# Altium project 724452_RPL-HX_Mobile_AEP_Rev0p91.PrjPcb (part 10 of 13)

## Sheet 0074_S0IX_REQ_ACK_OPTIO.SchDoc
size 848 x 558 mm
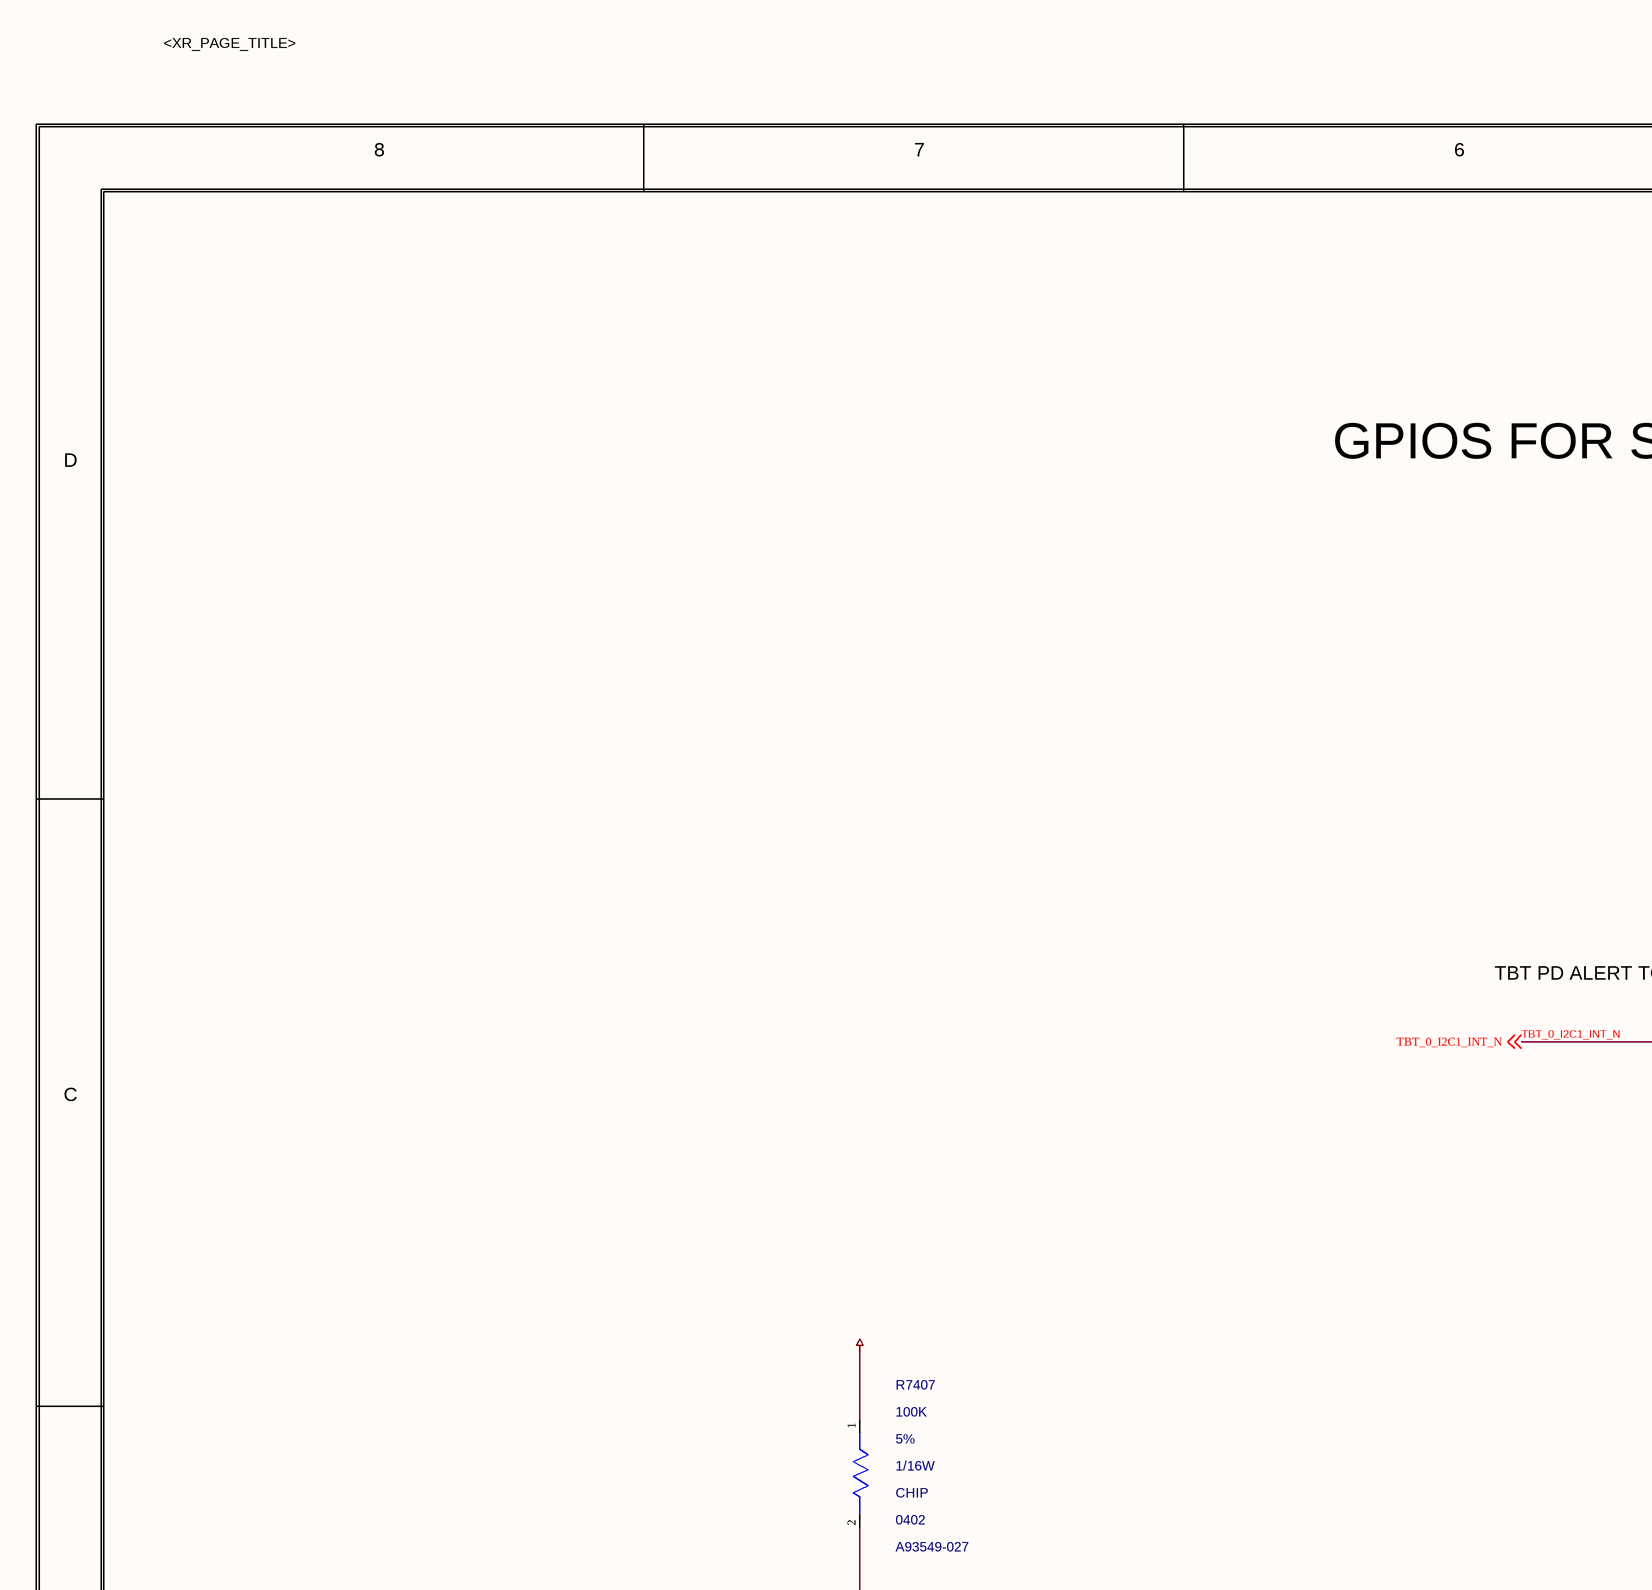
[diagram p122: 0074_S0IX_REQ_ACK_OPTIO.SchDoc, top left]
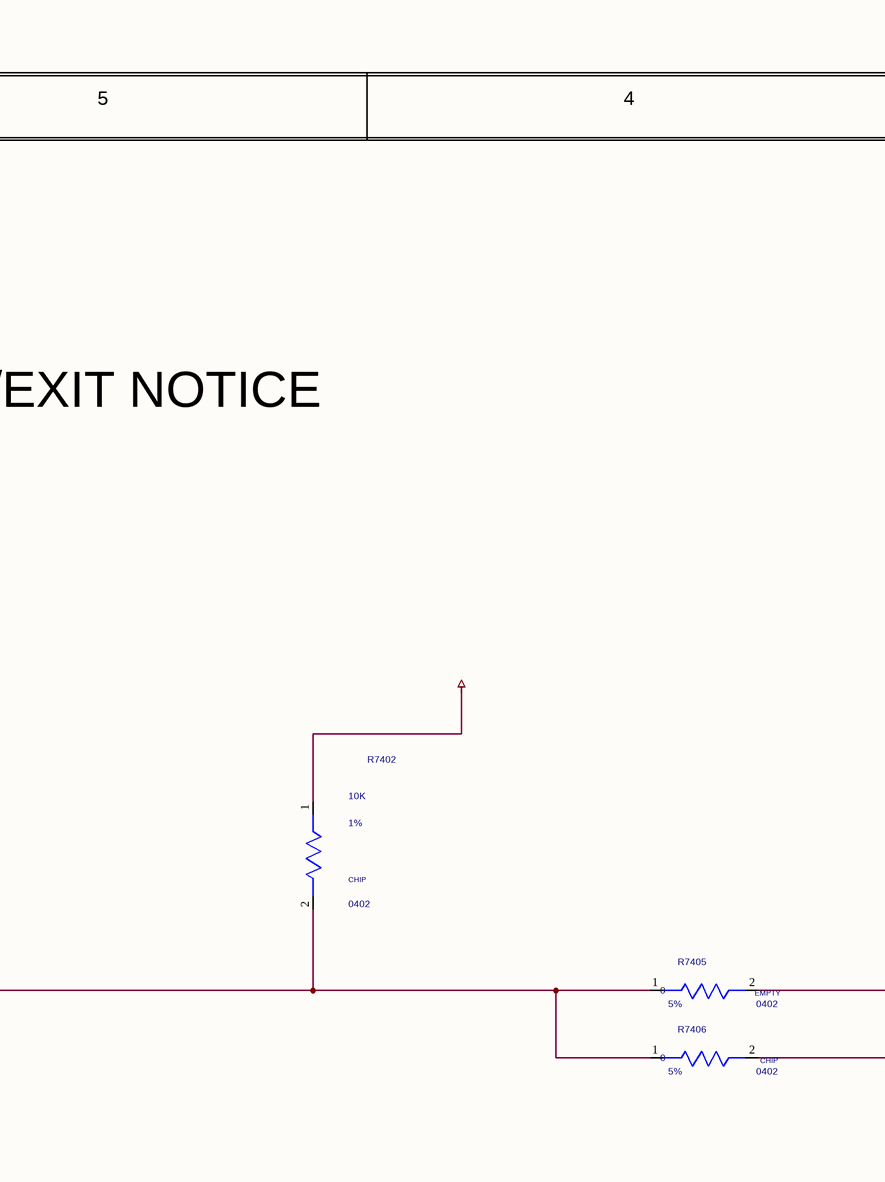
[diagram p123: 0074_S0IX_REQ_ACK_OPTIO.SchDoc, top middle]
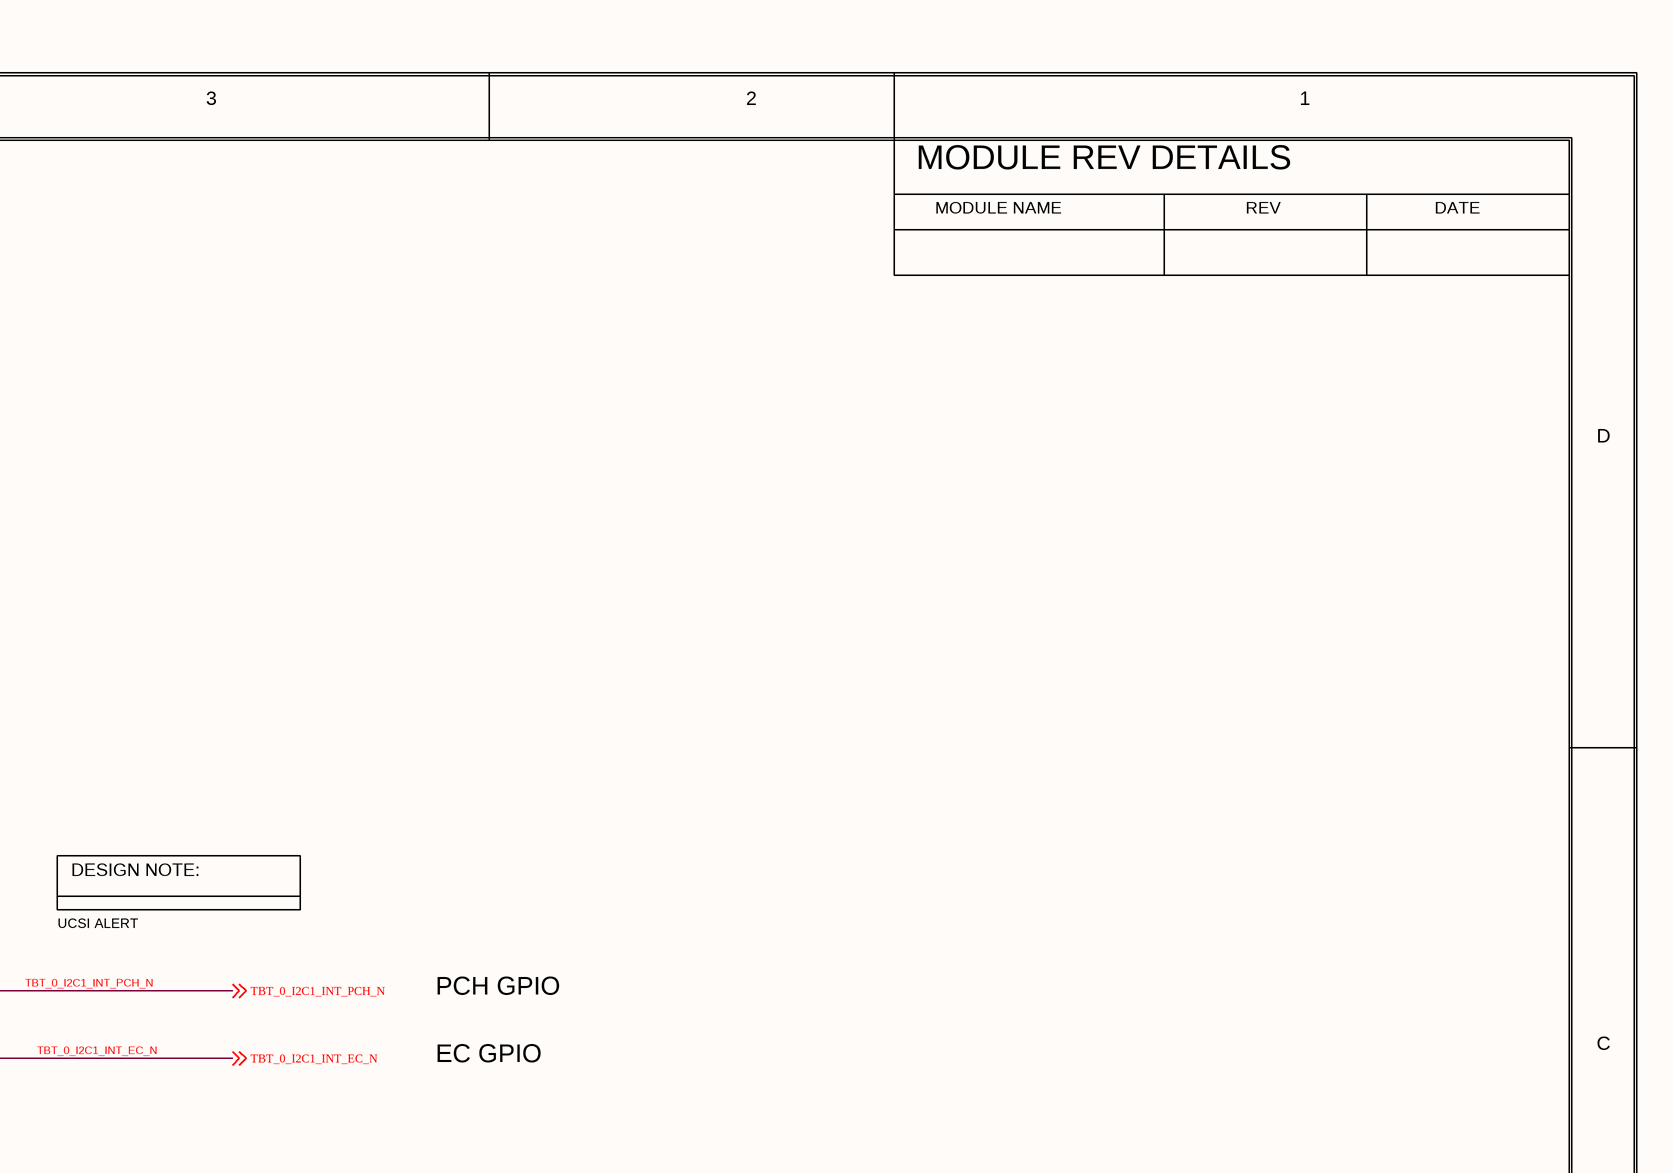
[diagram p124: 0074_S0IX_REQ_ACK_OPTIO.SchDoc, top right]
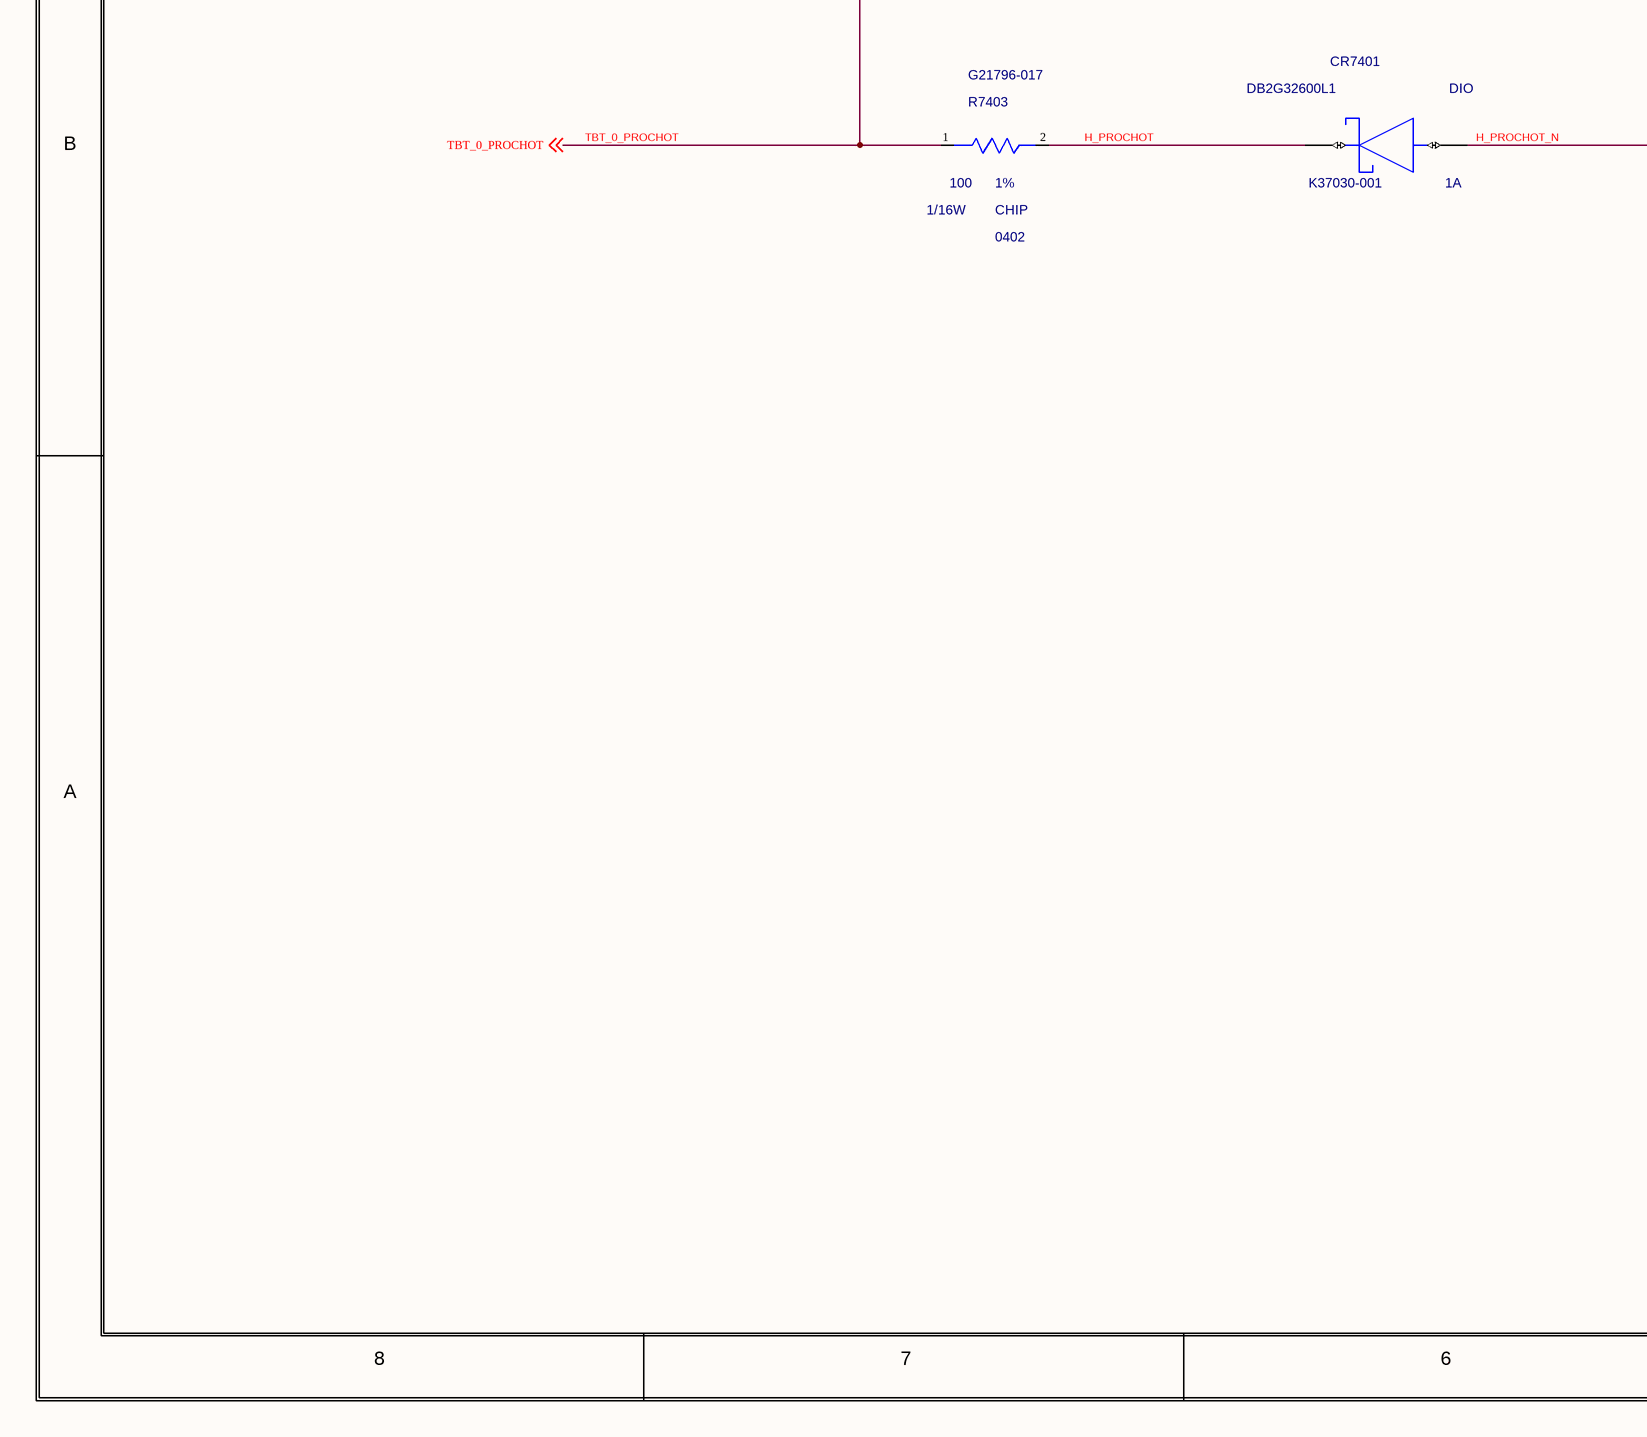
[diagram p125: 0074_S0IX_REQ_ACK_OPTIO.SchDoc, bottom left]
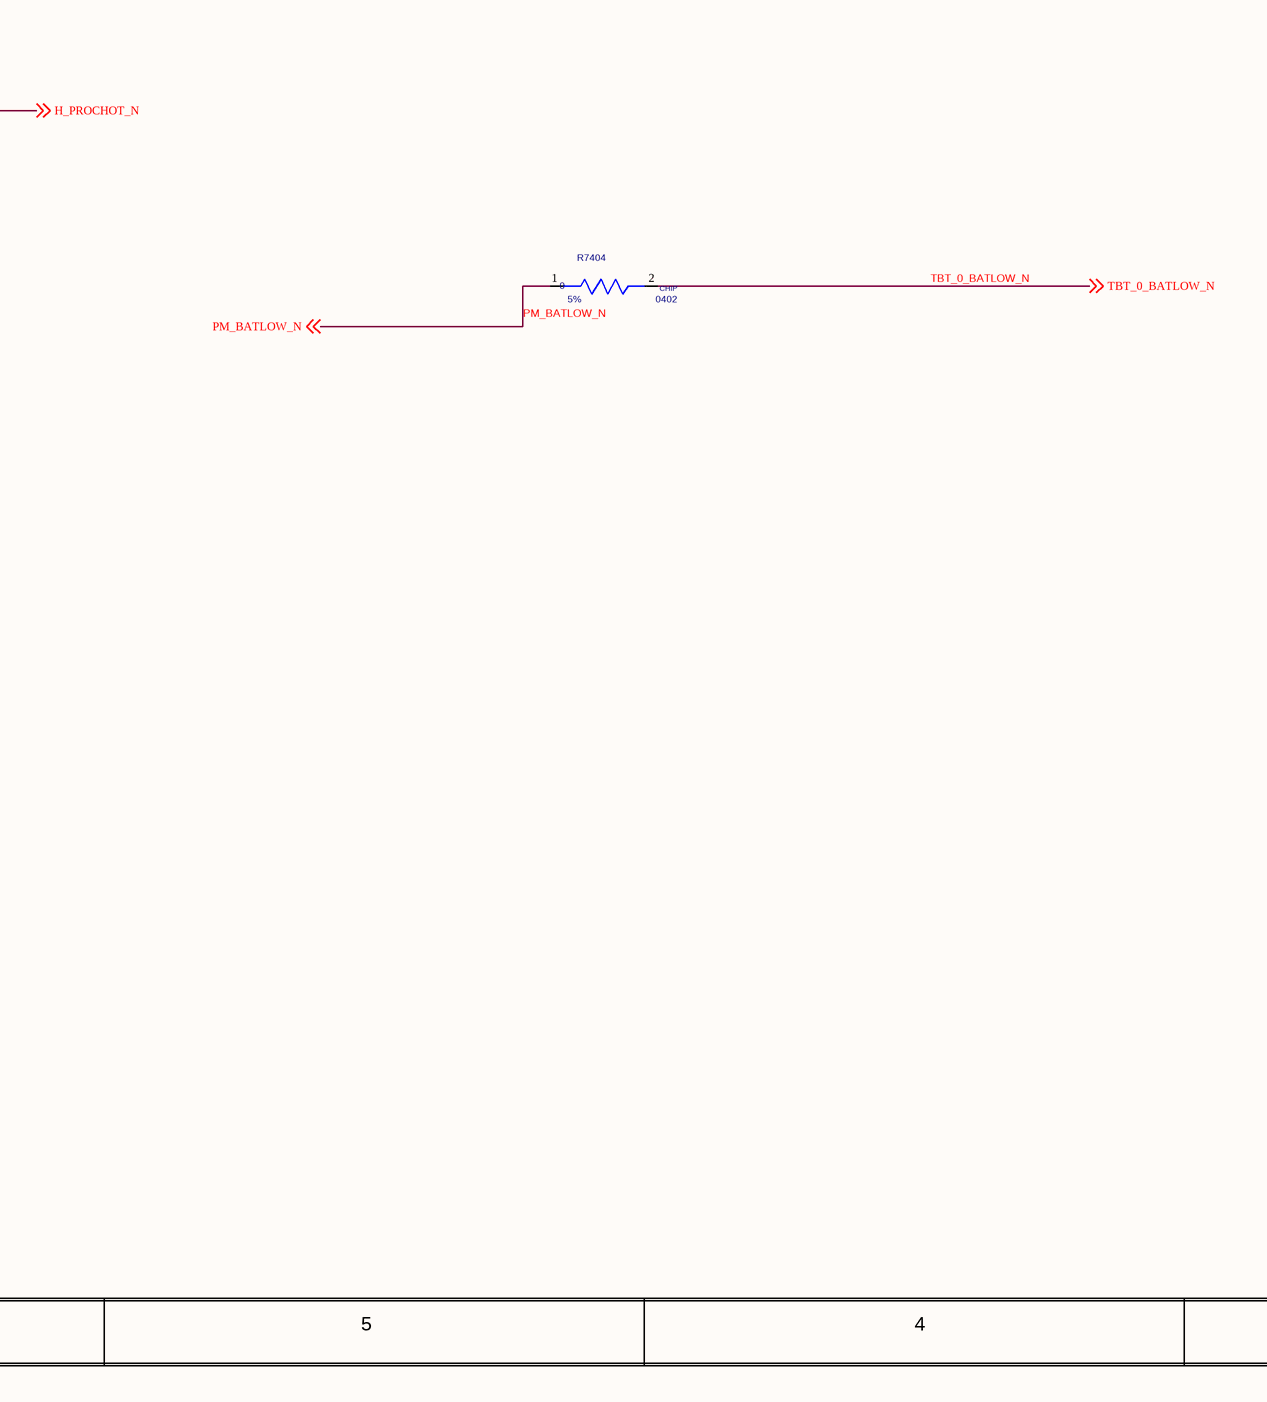
[diagram p126: 0074_S0IX_REQ_ACK_OPTIO.SchDoc, bottom middle]
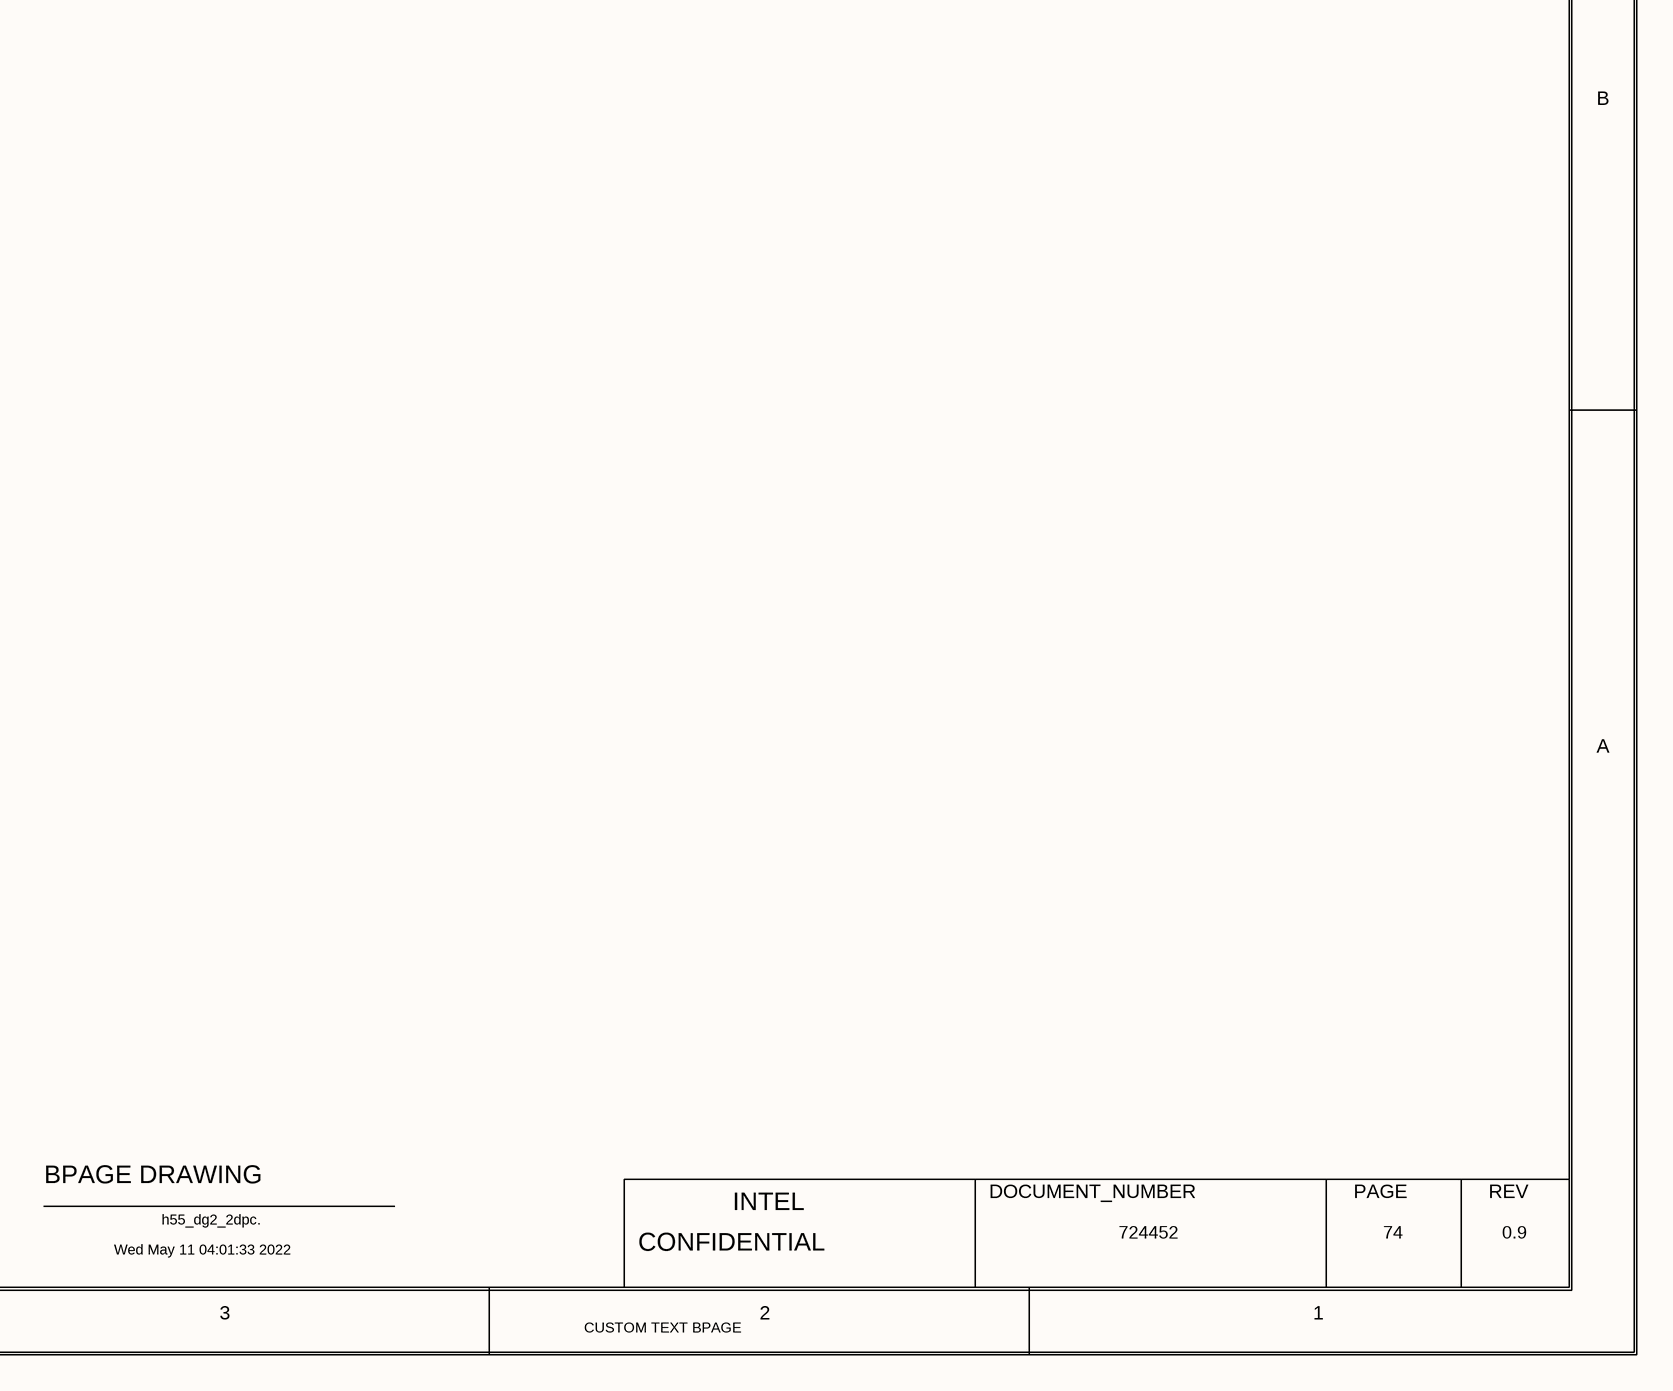
[diagram p127: 0074_S0IX_REQ_ACK_OPTIO.SchDoc, bottom right]

### Parts
CR7401  DB2G32600L1  CURRENT: 1A  MATERIAL: DIO  PART_NUMBER: K37030-001  [TK0_SCR0402_1050X650_MA]
R7402  10K  MATERIAL: CHIP  PACK_TYPE: 0402  TOLERANCE: 1%  [SMR0402IA]
R7403  100  MATERIAL: CHIP  PACK_TYPE: 0402  PART_NUMBER: G21796-017  TOLERANCE: 1%  WATTAGE: 1/16W  [SMR0402IA]
R7404  0  MATERIAL: CHIP  PACK_TYPE: 0402  TOLERANCE: 5%  [SMR0402IA]
R7405  0  MATERIAL: EMPTY  PACK_TYPE: 0402  TOLERANCE: 5%  [SMR0402IA]
R7406  0  MATERIAL: CHIP  PACK_TYPE: 0402  TOLERANCE: 5%  [SMR0402IA]
R7407  100K  MATERIAL: CHIP  PACK_TYPE: 0402  PART_NUMBER: A93549-027  TOLERANCE: 5%  WATTAGE: 1/16W  [SMR0402IA]

### Nets
+V3P3A: R7407.1(A)
+V3P3A_KBC: R7402.1(A)
H_PROCHOT: CR7401.1(CATHODE) R7403.2(B)
H_PROCHOT_N: CR7401.2(ANODE) ; off-sheet H_PROCHOT_N
PM_BATLOW_N: R7404.1(A) ; off-sheet PM_BATLOW_N
TBT_0_BATLOW_N: R7404.2(B) ; off-sheet TBT_0_BATLOW_N
TBT_0_I2C1_INT_EC_N: R7406.2(B) ; off-sheet TBT_0_I2C1_INT_EC_N
TBT_0_I2C1_INT_N: R7402.2(B) R7405.1(A) R7406.1(A) ; off-sheet TBT_0_I2C1_INT_N
TBT_0_I2C1_INT_PCH_N: R7405.2(B) ; off-sheet TBT_0_I2C1_INT_PCH_N
TBT_0_PROCHOT: R7403.1(A) R7407.2(B) ; off-sheet TBT_0_PROCHOT

### Notes on the sheet
- <XR_PAGE_TITLE>
- 8
- 7
- 6
- 5
- 4
- 3
- 2
- 1
- MODULE REV DETAILS
- MODULE NAME
- REV
- DATE
- D
- GPIOS FOR SX ENTRY/EXIT NOTICE
- DESIGN NOTE:
- TBT PD ALERT TO EC
- UCSI ALERT
- PCH GPIO
- C
- EC GPIO
- B
- A
- BPAGE DRAWING
- INTEL
- DOCUMENT_NUMBER
- PAGE
- Wed May 11 04:01:33 2022
- h55_dg2_2dpc.
- CONFIDENTIAL
- 724452
- 74
- 0.9
- CUSTOM TEXT BPAGE

### Library data of the parts
CR7401 = DIODE_SCHOTTKY_2: CDS_PHYS_PART_NAME: DIODE_SCHOTTKY_2_SM-K37030-001,DIO,DB2G32600L1,1A,TK0,GENERIC; BOM_USE: STUFF; CDS_LMAN_SYM_OUTLINE: -50,100,50,-100; FP_TECH: TK0; IP: GENERIC; PACK_TYPE: SM; ROOM: NONE; OriginalSymbolOrigin: (-75,50); XY: (-5625,2200); VER: 1; ROT: 2; PHYS_PAGE: 74; LOCATION: CR7401; DRAWING: @RVP1_ADL_SB_ADP_S_DDR5_SODIMM_2DPC_LIB.H55_DG2_2DPC(SCH_1):PAGE74; CDS_LIB: local; VARIANT: ?; PCB Footprint: TK0_SCR0402_1050X650_MA; CHIPS_PART_NAME: DIODE_SCHOTTKY_2; CDS_PART_NAME: DIODE_SCHOTTKY_2_SM-K37030-001,DIO,DB2G32600L1,1A,TK0,GENERIC; CDS_LOCATION: CR7401
R7402 = RES: PART_NUMBER: A93548-034; CDS_PHYS_PART_NAME: RES_0402-A93548-034,CHIP,10K,1%,1/16W,LPDB,GENERIC; WATTAGE: 1/16W; OriginalSymbolOrigin: (-25,75); XY: (-4100,3675); VER: 2; ROT: 0; PHYS_PAGE: 74; LOCATION: R7402; IP: GENERIC; FP_TECH: LPDB; DRAWING: @RVP1_ADL_SB_ADP_S_DDR5_SODIMM_2DPC_LIB.H55_DG2_2DPC(SCH_1):PAGE74; CDS_LIB: discrete; PCB Footprint: SMR0402IA; SEC_TYPE: 0402; CHIPS_PART_NAME: RES; CDS_PART_NAME: RES_0402-A93548-034,CHIP,10K,1%,1/16W,LPDB,GENERIC; CDS_LOCATION: R7402; ASI_MODEL: A93548-034
R7403 = RES#1: CHIPS_PART_NAME: RES; CDS_PHYS_PART_NAME: RES_0402-G21796-017,CHIP,100,1%,1/16W,LPDB,GENERIC; OriginalSymbolOrigin: (-75,25); XY: (-6350,2200); VER: 1; ROT: 0; PHYS_PAGE: 74; LOCATION: R7403; IP: GENERIC; FP_TECH: LPDB; DRAWING: @RVP1_ADL_SB_ADP_S_DDR5_SODIMM_2DPC_LIB.H55_DG2_2DPC(SCH_1):PAGE74; CDS_LIB: discrete; PCB Footprint: SMR0402IA; CDS_PART_NAME: RES_0402-G21796-017,CHIP,100,1%,1/16W,LPDB,GENERIC; CDS_LOCATION: R7403
R7404 = RES#1: PART_NUMBER: A93549-001; CHIPS_PART_NAME: RES; CDS_PHYS_PART_NAME: RES_0402-A93549-001,CHIP,0,5%,1/16W,LPDB,GENERIC; WATTAGE: 1/16W; OriginalSymbolOrigin: (-75,25); XY: (-4075,1875); VER: 1; PHYS_PAGE: 74; LOCATION: R7404; IP: GENERIC; FP_TECH: LPDB; DRAWING: @RVP1_ADL_SB_ADP_S_DDR5_SODIMM_2DPC_LIB.H55_DG2_2DPC(SCH_1):PAGE74; CDS_LIB: discrete; PCB Footprint: SMR0402IA; ROT: 0; CDS_PART_NAME: RES_0402-A93549-001,CHIP,0,5%,1/16W,LPDB,GENERIC; CDS_LOCATION: R7404; ASI_MODEL: A93549-001
R7405 = RES#1: PART_NUMBER: A93549-001; CHIPS_PART_NAME: RES; CDS_PHYS_PART_NAME: RES_0402-A93549-001,EMPTY,0,5%,1/16W,LPDB,GENERIC; WATTAGE: 1/16W; OriginalSymbolOrigin: (-75,25); XY: (-3375,3425); VER: 1; PHYS_PAGE: 74; LOCATION: R7405; IP: GENERIC; FP_TECH: LPDB; DRAWING: @RVP1_ADL_SB_ADP_S_DDR5_SODIMM_2DPC_LIB.H55_DG2_2DPC(SCH_1):PAGE74; CDS_LIB: discrete; PCB Footprint: SMR0402IA; ROT: 0; CDS_PART_NAME: RES_0402-A93549-001,EMPTY,0,5%,1/16W,LPDB,GENERIC; CDS_LOCATION: R7405; ASI_MODEL: A93549-001
R7406 = RES#1: PART_NUMBER: A93549-001; CHIPS_PART_NAME: RES; CDS_PHYS_PART_NAME: RES_0402-A93549-001,CHIP,0,5%,1/16W,LPDB,GENERIC; WATTAGE: 1/16W; OriginalSymbolOrigin: (-75,25); XY: (-3375,3300); VER: 1; PHYS_PAGE: 74; LOCATION: R7406; IP: GENERIC; FP_TECH: LPDB; DRAWING: @RVP1_ADL_SB_ADP_S_DDR5_SODIMM_2DPC_LIB.H55_DG2_2DPC(SCH_1):PAGE74; CDS_LIB: discrete; PCB Footprint: SMR0402IA; ROT: 0; CDS_PART_NAME: RES_0402-A93549-001,CHIP,0,5%,1/16W,LPDB,GENERIC; CDS_LOCATION: R7406; ASI_MODEL: A93549-001
R7407 = RES: CDS_PHYS_PART_NAME: RES_0402-A93549-027,CHIP,100K,5%,1/16W,LPDB,GENERIC; OriginalSymbolOrigin: (-25,75); XY: (-6600,2625); VER: 2; ROT: 0; PHYS_PAGE: 74; LOCATION: R7407; IP: GENERIC; FP_TECH: LPDB; DRAWING: @RVP1_ADL_SB_ADP_S_DDR5_SODIMM_2DPC_LIB.H55_DG2_2DPC(SCH_1):PAGE74; CDS_LIB: discrete; PCB Footprint: SMR0402IA; CHIPS_PART_NAME: RES; CDS_PART_NAME: RES_0402-A93549-027,CHIP,100K,5%,1/16W,LPDB,GENERIC; CDS_LOCATION: R7407

## Sheet 0076_TBT_0_PA_CONNECTOR.SchDoc
size A3
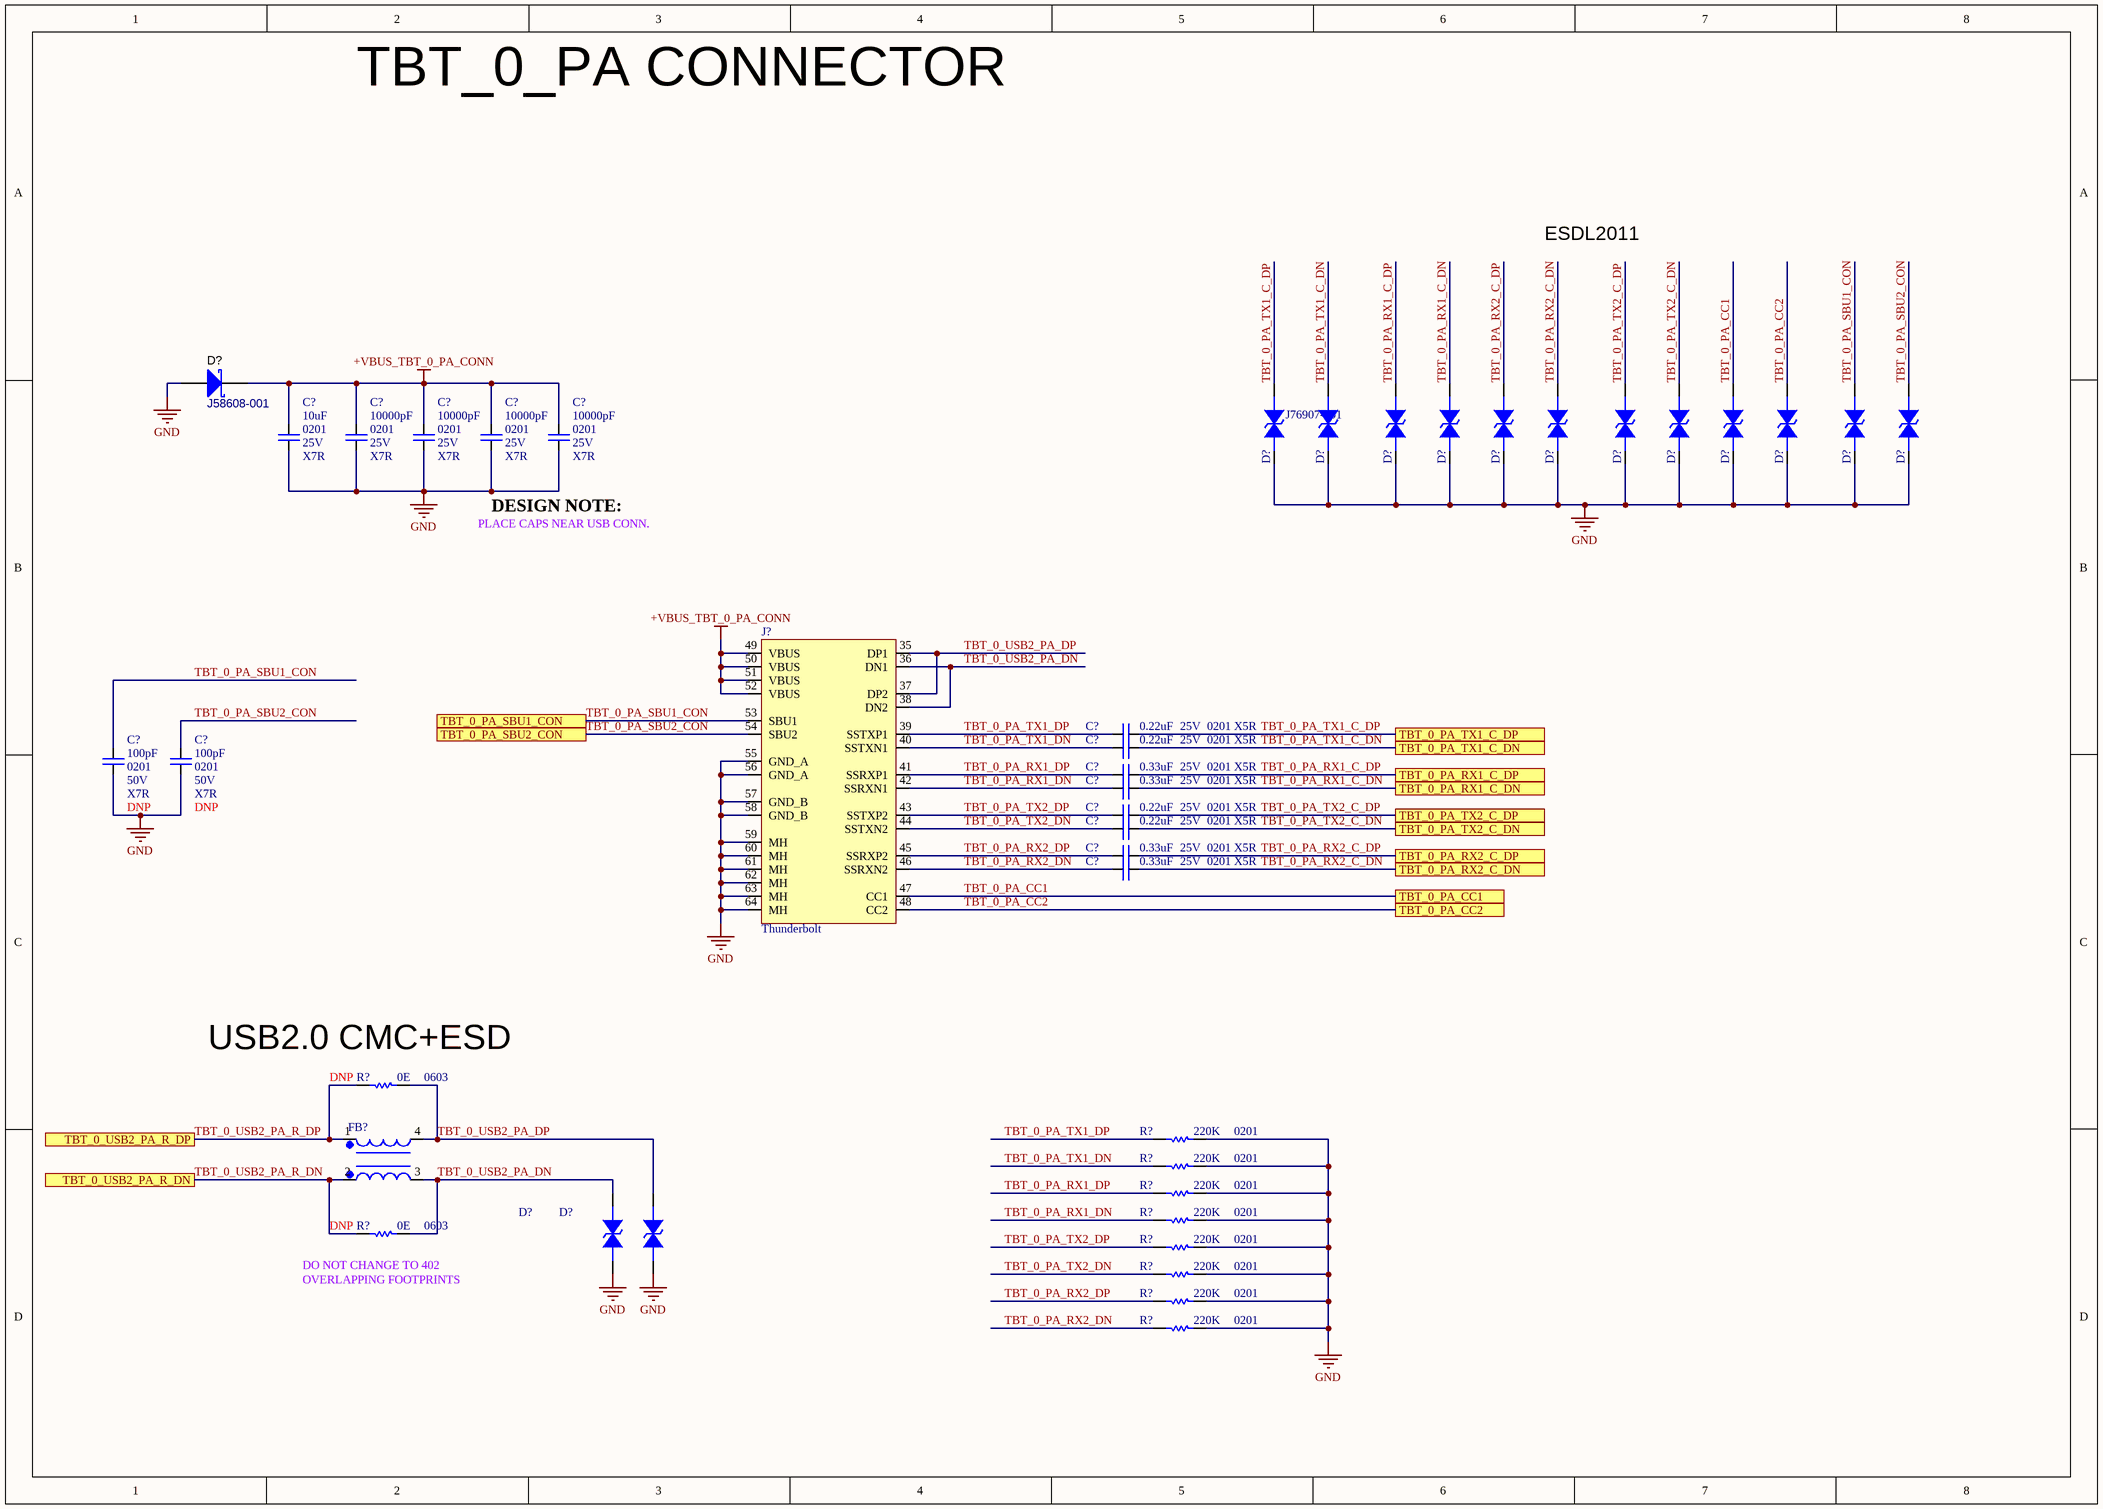
[diagram p128: 0076_TBT_0_PA_CONNECTOR.SchDoc]

### Parts
(Parts that share a designator on the sheet are numbered #1, #2 ... from top to bottom, then left to right.)
C?#195  value 10uF  Case/Package: 0201  Voltage: 25V  Dielectric: X7R  [CAPC0201]
C?#196  value 10000pF  Case/Package: 0201  Voltage: 25V  Dielectric: X7R  [CAPC0201]
C?#197  value 10000pF  Case/Package: 0201  Voltage: 25V  Dielectric: X7R  [CAPC0201]
C?#198  value 10000pF  Case/Package: 0201  Voltage: 25V  Dielectric: X7R  [CAPC0201]
C?#199  value 10000pF  Case/Package: 0201  Voltage: 25V  Dielectric: X7R  [CAPC0201]
C?#200  value 0.22uF  Case/Package: 0201  Voltage: 25V  Dielectric: X5R  [CAPC0201]
C?#201  value 0.22uF  Case/Package: 0201  Voltage: 25V  Dielectric: X5R  [CAPC0201]
C?#202  value 100pF  Case/Package: 0201  Voltage: 50V  Dielectric: X7R  [CAPC0201]
C?#203  value 100pF  Case/Package: 0201  Voltage: 50V  Dielectric: X7R  [CAPC0201]
C?#204  value 0.33uF  Case/Package: 0201  Voltage: 25V  Dielectric: X5R  [CAPC0201]
C?#205  value 0.33uF  Case/Package: 0201  Voltage: 25V  Dielectric: X5R  [CAPC0201]
C?#206  value 0.22uF  Case/Package: 0201  Voltage: 25V  Dielectric: X5R  [CAPC0201]
C?#207  value 0.22uF  Case/Package: 0201  Voltage: 25V  Dielectric: X5R  [CAPC0201]
C?#208  value 0.33uF  Case/Package: 0201  Voltage: 25V  Dielectric: X5R  [CAPC0201]
C?#209  value 0.33uF  Case/Package: 0201  Voltage: 25V  Dielectric: X5R  [CAPC0201]
D?#17  J58608-001
D?#18  Manufacturer Part Number: J76907-001  (hidden comment: ESD5341N)
D?#19  ESD5341N  (value not drawn)
D?#20  ESD5341N  (value not drawn)
D?#21  ESD5341N  (value not drawn)
D?#22  ESD5341N  (value not drawn)
D?#23  ESD5341N  (value not drawn)
D?#24  ESD5341N  (value not drawn)
D?#25  ESD5341N  (value not drawn)
D?#26  ESD5341N  [ESD0402]  (value not drawn)
D?#27  ESD5341N  [ESD0402]  (value not drawn)
D?#28  ESD5341N  [ESD0402]  (value not drawn)
D?#29  ESD5341N  [ESD0402]  (value not drawn)
D?#30  ESD5341N  [ESD0402]  (value not drawn)
D?#31  ESD5341N  [ESD0402]  (value not drawn)
FB?#14  WCM3216F2SF-900T04  [CHOKE]  (value not drawn)
J?#9  Thunderbolt
R?#353  value 0E  Case/Package: 0603  [RESC0603]  (hidden comment: Res)
R?#354  value 220K  Case/Package: 0201  [RESC0201]  (hidden comment: Res)
R?#355  value 220K  Case/Package: 0201  [RESC0201]  (hidden comment: Res)
R?#356  value 220K  Case/Package: 0201  [RESC0201]  (hidden comment: Res)
R?#357  value 220K  Case/Package: 0201  [RESC0201]  (hidden comment: Res)
R?#358  value 0E  Case/Package: 0603  [RESC0603]  (hidden comment: Res)
R?#359  value 220K  Case/Package: 0201  [RESC0201]  (hidden comment: Res)
R?#360  value 220K  Case/Package: 0201  [RESC0201]  (hidden comment: Res)
R?#361  value 220K  Case/Package: 0201  [RESC0201]  (hidden comment: Res)
R?#362  value 220K  Case/Package: 0201  [RESC0201]  (hidden comment: Res)

### Ports
TBT_0_PA_CC1, TBT_0_PA_CC2, TBT_0_PA_RX1_C_DN, TBT_0_PA_RX1_C_DP, TBT_0_PA_RX2_C_DN, TBT_0_PA_RX2_C_DP, TBT_0_PA_SBU1_CON, TBT_0_PA_SBU2_CON, TBT_0_PA_TX1_C_DN, TBT_0_PA_TX1_C_DP, TBT_0_PA_TX2_C_DN, TBT_0_PA_TX2_C_DP, TBT_0_USB2_PA_R_DN, TBT_0_USB2_PA_R_DP

### Nets
+VBUS_TBT_0_PA_CONN: C?#195.1 C?#196.1 C?#197.1 C?#198.1 C?#199.1 D?#17.K J?#9.49(VBUS) J?#9.50(VBUS) J?#9.51(VBUS) J?#9.52(VBUS)
GND: C?#195.2 C?#196.2 C?#197.2 C?#198.2 C?#199.2 C?#202.2 C?#203.2 D?#17.A D?#18.1 D?#19.1 D?#20.1 D?#21.1 D?#22.1 D?#23.1 D?#24.1 D?#25.1 D?#26.1 D?#27.1 D?#28.1 D?#29.1 D?#30.2 D?#31.2 J?#9.55(GND_A) J?#9.56(GND_A) J?#9.57(GND_B) J?#9.58(GND_B) J?#9.59(MH) J?#9.60(MH) J?#9.61(MH) J?#9.62(MH) J?#9.63(MH) J?#9.64(MH) R?#354.2 R?#355.2 R?#356.2 R?#357.2 R?#359.2 R?#360.2 R?#361.2 R?#362.2  [project net EXP_A_RX_4_DP]
TBT_0_PA_CC1: D?#26.2 J?#9.47(CC1) ; port TBT_0_PA_CC1
TBT_0_PA_CC2: D?#27.2 J?#9.48(CC2) ; port TBT_0_PA_CC2
TBT_0_PA_RX1_C_DN: C?#205.2 D?#21.2 ; port TBT_0_PA_RX1_C_DN
TBT_0_PA_RX1_C_DP: C?#204.2 D?#20.2 ; port TBT_0_PA_RX1_C_DP
TBT_0_PA_RX1_DN: C?#205.1 J?#9.42(SSRXN1) R?#357.1
TBT_0_PA_RX1_DP: C?#204.1 J?#9.41(SSRXP1) R?#356.1
TBT_0_PA_RX2_C_DN: C?#209.2 D?#23.2 ; port TBT_0_PA_RX2_C_DN
TBT_0_PA_RX2_C_DP: C?#208.2 D?#22.2 ; port TBT_0_PA_RX2_C_DP
TBT_0_PA_RX2_DN: C?#209.1 J?#9.46(SSRXN2) R?#362.1
TBT_0_PA_RX2_DP: C?#208.1 J?#9.45(SSRXP2) R?#361.1
TBT_0_PA_SBU1_CON: C?#202.1 D?#28.2 J?#9.53(SBU1) ; port TBT_0_PA_SBU1_CON
TBT_0_PA_SBU2_CON: C?#203.1 D?#29.2 J?#9.54(SBU2) ; port TBT_0_PA_SBU2_CON
TBT_0_PA_TX1_C_DN: C?#201.2 D?#19.2 ; port TBT_0_PA_TX1_C_DN
TBT_0_PA_TX1_C_DP: C?#200.2 D?#18.2 ; port TBT_0_PA_TX1_C_DP
TBT_0_PA_TX1_DN: C?#201.1 J?#9.40(SSTXN1) R?#355.1
TBT_0_PA_TX1_DP: C?#200.1 J?#9.39(SSTXP1) R?#354.1
TBT_0_PA_TX2_C_DN: C?#207.2 D?#25.2 ; port TBT_0_PA_TX2_C_DN
TBT_0_PA_TX2_C_DP: C?#206.2 D?#24.2 ; port TBT_0_PA_TX2_C_DP
TBT_0_PA_TX2_DN: C?#207.1 J?#9.44(SSTXN2) R?#360.1
TBT_0_PA_TX2_DP: C?#206.1 J?#9.43(SSTXP2) R?#359.1
TBT_0_USB2_PA_DN: D?#30.1 FB?#14.3 J?#9.36(DN1) J?#9.38(DN2) R?#358.2
TBT_0_USB2_PA_DP: D?#31.1 FB?#14.4 J?#9.35(DP1) J?#9.37(DP2) R?#353.2
TBT_0_USB2_PA_R_DN: FB?#14.2 R?#358.1 ; port TBT_0_USB2_PA_R_DN
TBT_0_USB2_PA_R_DP: FB?#14.1 R?#353.1 ; port TBT_0_USB2_PA_R_DP

### Notes on the sheet
- TBT_0_PA CONNECTOR
- ESDL2011
- DESIGN NOTE:
- PLACE CAPS NEAR USB CONN.
- (near R?#353) USB2.0 CMC+ESD
- (near R?#358) OVERLAPPING FOOTPRINTS
- (near R?#358) DO NOT CHANGE TO 402

### Library data of the parts
C?#195 = Cap: CAP CER 10uF 25V X5R 0201
C?#196-C?#199 = Cap: CAP CER 10000pF 25V X7R 0201
C?#200 C?#201 C?#206 C?#207 = Cap: CAP CER 0.22uF 25V X5R 0201
C?#202 C?#203 = Cap: CAP CER 100pF 50V X7R 0201; DNP: DNP
C?#204 C?#205 C?#208 C?#209 = Cap: CAP CER 0.33uF 25V X5R 0201
D?#17 = SCHOTTKY: Diode, Schottky, 40V, 5A, SMC; ComponentLink1Description: Datasheet link; ComponentLink1URL: http://www.comchip.com.tw/cms/UserFiles/QW-BB012%20CDBC520-G%7E5100-G%20RevC809622.pdf; Manufacturer Part Number: *; Case/Package: *
D?#18 D?#26-D?#29 = ESD5341N: 1-Line, Bi-directional, Transient Voltage Suppressors.1pF.; Case/Package: 0201
  D?#26-D?#29: Manufacturer Part Number: ESD5341N
D?#19-D?#25 D?#30 D?#31 = ESD5341N: 1-Line, Bi-directional, Transient Voltage Suppressors.1pF.; Manufacturer Part Number: J76907-001; Case/Package: 0201
FB?#14 = WCM3216F2SF-900T04: Power, Signal Line 90 Ohms @ 100MHz 300 mOhm 50V SMD,3.2x1.6x2mm Common Mode Filters RoHS; Manufacturer Part Number: WCM3216F2SF-900T04; Case/Package: 3.2x1.6x2mm
R?#353 R?#358 = Res: Thick Film Resistor - 0ohm, 1%, 0603; DNP: DNP
R?#354-R?#357 R?#359-R?#362 = Res: Thick Film Resistor -  220Kohm, 1%, 0201

## Sheet 0077_TBT_0_PB_CONNECTOR.SchDoc
size A3
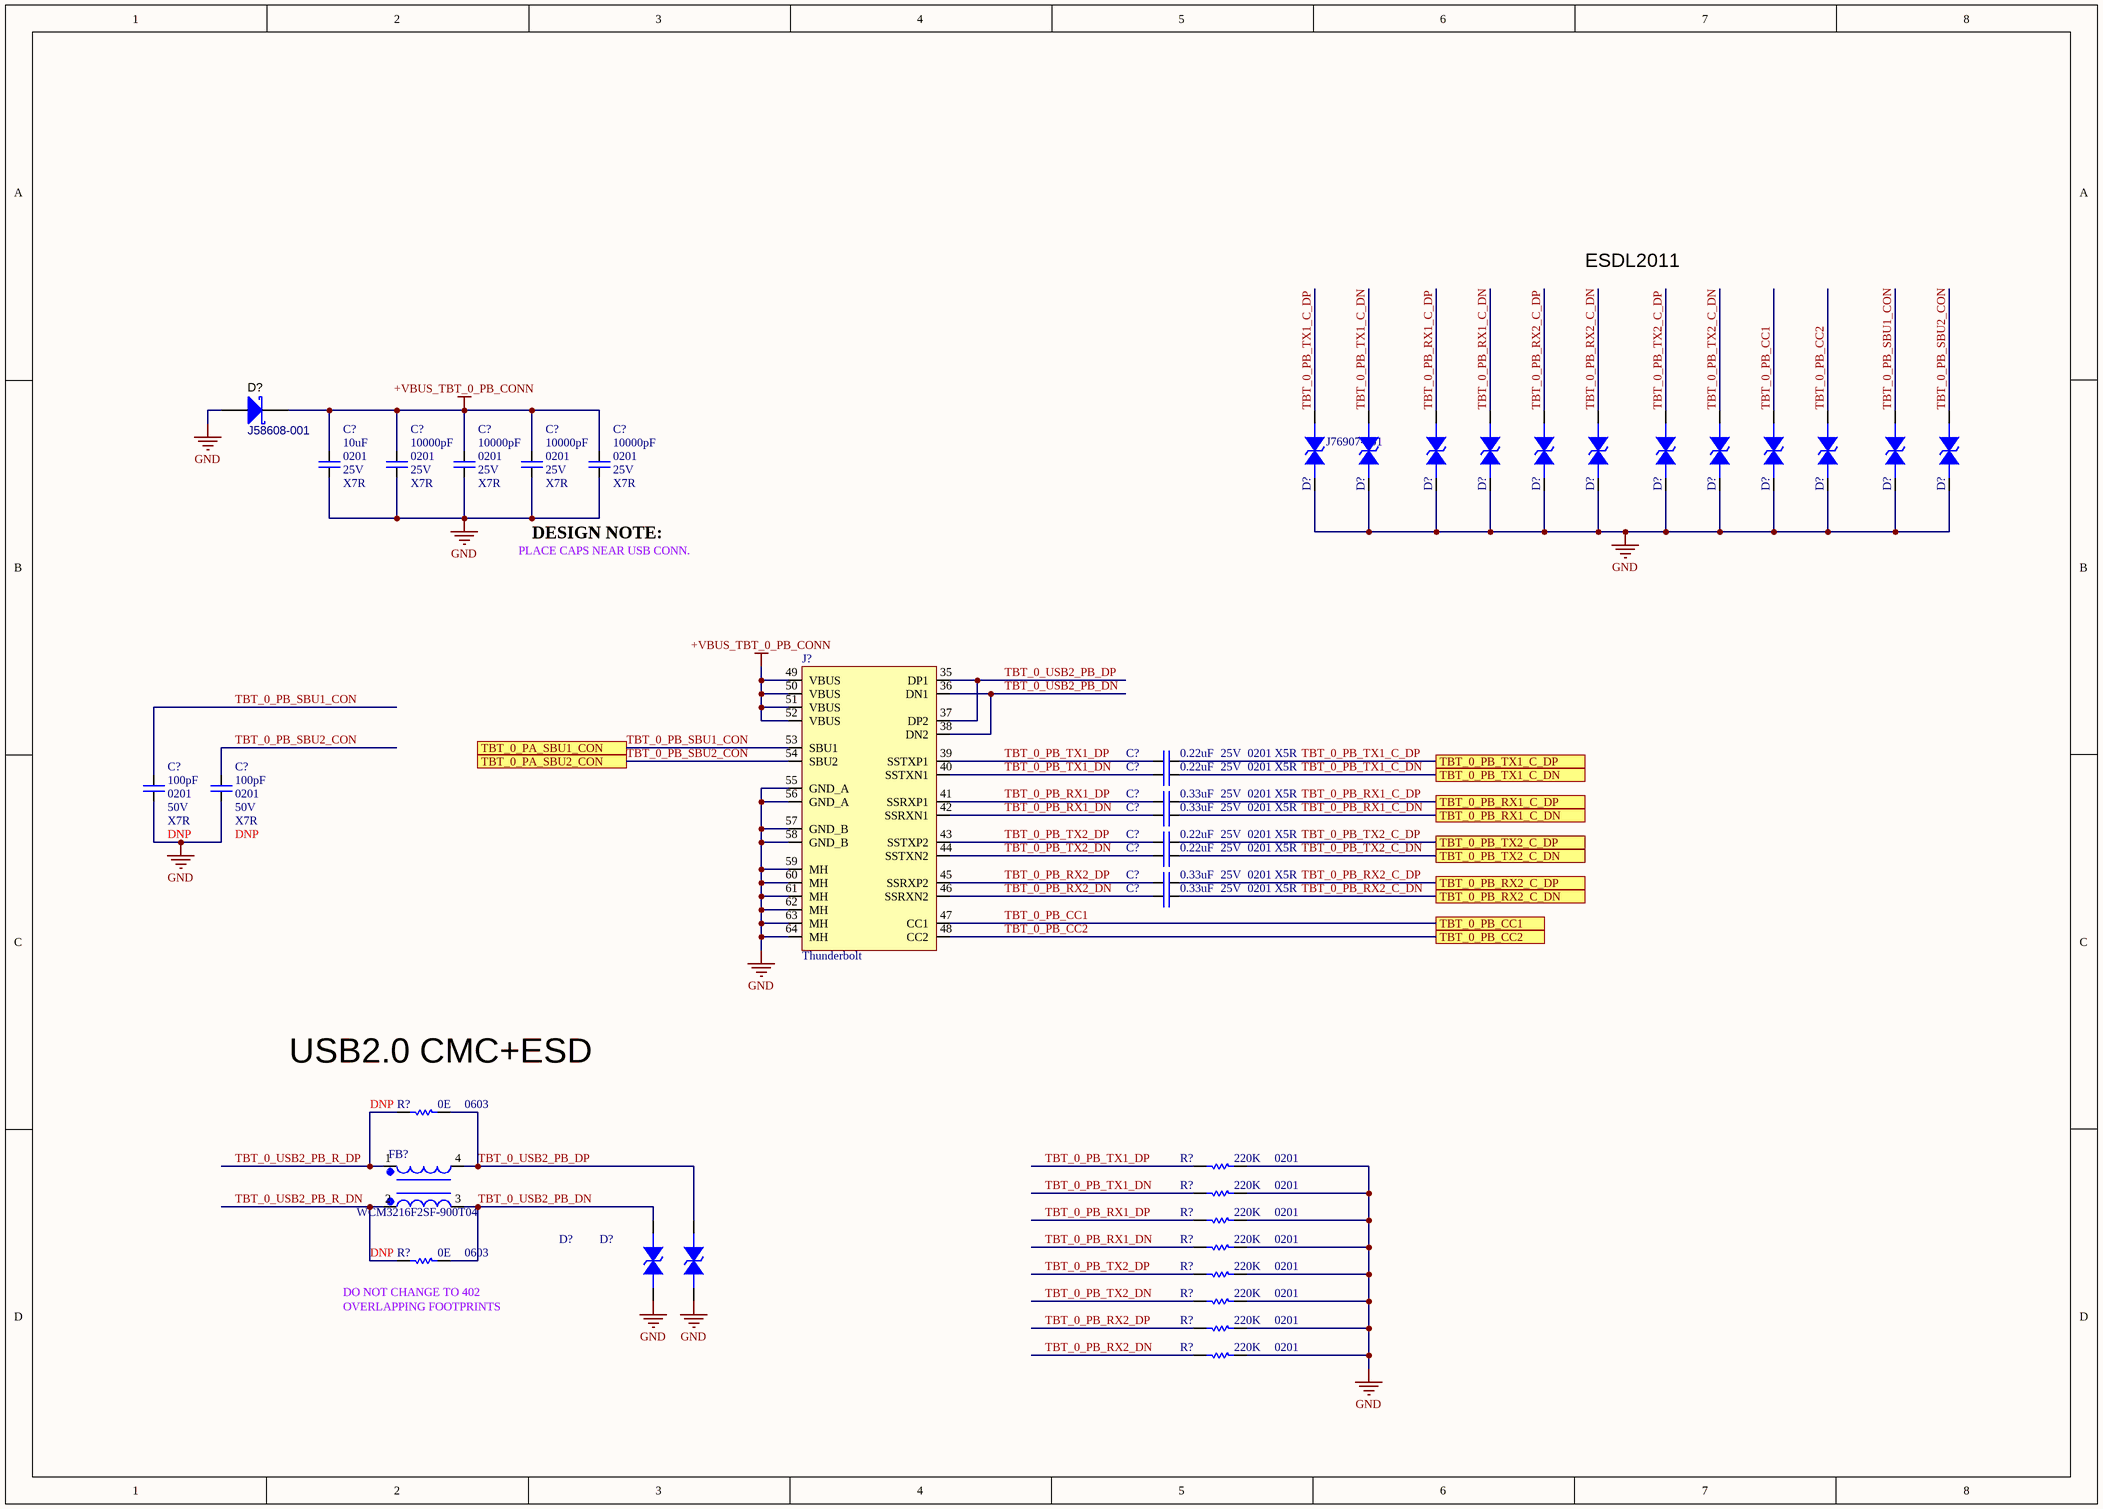
[diagram p129: 0077_TBT_0_PB_CONNECTOR.SchDoc]

### Parts
(Parts that share a designator on the sheet are numbered #1, #2 ... from top to bottom, then left to right.)
C?#210  value 10uF  Case/Package: 0201  Voltage: 25V  Dielectric: X7R  [CAPC0201]
C?#211  value 10000pF  Case/Package: 0201  Voltage: 25V  Dielectric: X7R  [CAPC0201]
C?#212  value 10000pF  Case/Package: 0201  Voltage: 25V  Dielectric: X7R  [CAPC0201]
C?#213  value 10000pF  Case/Package: 0201  Voltage: 25V  Dielectric: X7R  [CAPC0201]
C?#214  value 10000pF  Case/Package: 0201  Voltage: 25V  Dielectric: X7R  [CAPC0201]
C?#215  value 0.22uF  Case/Package: 0201  Voltage: 25V  Dielectric: X5R  [CAPC0201]
C?#216  value 0.22uF  Case/Package: 0201  Voltage: 25V  Dielectric: X5R  [CAPC0201]
C?#217  value 100pF  Case/Package: 0201  Voltage: 50V  Dielectric: X7R  [CAPC0201]
C?#218  value 100pF  Case/Package: 0201  Voltage: 50V  Dielectric: X7R  [CAPC0201]
C?#219  value 0.33uF  Case/Package: 0201  Voltage: 25V  Dielectric: X5R  [CAPC0201]
C?#220  value 0.33uF  Case/Package: 0201  Voltage: 25V  Dielectric: X5R  [CAPC0201]
C?#221  value 0.22uF  Case/Package: 0201  Voltage: 25V  Dielectric: X5R  [CAPC0201]
C?#222  value 0.22uF  Case/Package: 0201  Voltage: 25V  Dielectric: X5R  [CAPC0201]
C?#223  value 0.33uF  Case/Package: 0201  Voltage: 25V  Dielectric: X5R  [CAPC0201]
C?#224  value 0.33uF  Case/Package: 0201  Voltage: 25V  Dielectric: X5R  [CAPC0201]
D?#32  J58608-001
D?#33  Manufacturer Part Number: J76907-001  (hidden comment: ESD5341N)
D?#34  ESD5341N  (value not drawn)
D?#35  ESD5341N  (value not drawn)
D?#36  ESD5341N  (value not drawn)
D?#37  ESD5341N  (value not drawn)
D?#38  ESD5341N  (value not drawn)
D?#39  ESD5341N  (value not drawn)
D?#40  ESD5341N  (value not drawn)
D?#41  ESD5341N  [ESD0402]  (value not drawn)
D?#42  ESD5341N  [ESD0402]  (value not drawn)
D?#43  ESD5341N  [ESD0402]  (value not drawn)
D?#44  ESD5341N  [ESD0402]  (value not drawn)
D?#45  ESD5341N  [ESD0402]  (value not drawn)
D?#46  ESD5341N  [ESD0402]  (value not drawn)
FB?#15  WCM3216F2SF-900T04  [CHOKE]
J?#10  Thunderbolt
R?#363  value 0E  Case/Package: 0603  [RESC0603]  (hidden comment: Res)
R?#364  value 220K  Case/Package: 0201  [RESC0201]  (hidden comment: Res)
R?#365  value 220K  Case/Package: 0201  [RESC0201]  (hidden comment: Res)
R?#366  value 220K  Case/Package: 0201  [RESC0201]  (hidden comment: Res)
R?#367  value 220K  Case/Package: 0201  [RESC0201]  (hidden comment: Res)
R?#368  value 0E  Case/Package: 0603  [RESC0603]  (hidden comment: Res)
R?#369  value 220K  Case/Package: 0201  [RESC0201]  (hidden comment: Res)
R?#370  value 220K  Case/Package: 0201  [RESC0201]  (hidden comment: Res)
R?#371  value 220K  Case/Package: 0201  [RESC0201]  (hidden comment: Res)
R?#372  value 220K  Case/Package: 0201  [RESC0201]  (hidden comment: Res)

### Ports
TBT_0_PA_SBU1_CON, TBT_0_PA_SBU2_CON, TBT_0_PB_CC1, TBT_0_PB_CC2, TBT_0_PB_RX1_C_DN, TBT_0_PB_RX1_C_DP, TBT_0_PB_RX2_C_DN, TBT_0_PB_RX2_C_DP, TBT_0_PB_TX1_C_DN, TBT_0_PB_TX1_C_DP, TBT_0_PB_TX2_C_DN, TBT_0_PB_TX2_C_DP

### Nets
+VBUS_TBT_0_PB_CONN: C?#210.1 C?#211.1 C?#212.1 C?#213.1 C?#214.1 D?#32.K J?#10.49(VBUS) J?#10.50(VBUS) J?#10.51(VBUS) J?#10.52(VBUS)
GND: C?#210.2 C?#211.2 C?#212.2 C?#213.2 C?#214.2 C?#217.2 C?#218.2 D?#32.A D?#33.1 D?#34.1 D?#35.1 D?#36.1 D?#37.1 D?#38.1 D?#39.1 D?#40.1 D?#41.1 D?#42.1 D?#43.1 D?#44.1 D?#45.2 D?#46.2 J?#10.55(GND_A) J?#10.56(GND_A) J?#10.57(GND_B) J?#10.58(GND_B) J?#10.59(MH) J?#10.60(MH) J?#10.61(MH) J?#10.62(MH) J?#10.63(MH) J?#10.64(MH) R?#364.2 R?#365.2 R?#366.2 R?#367.2 R?#369.2 R?#370.2 R?#371.2 R?#372.2  [project net EXP_A_RX_4_DP]
TBT_0_PB_CC1: D?#41.2 J?#10.47(CC1) ; port TBT_0_PB_CC1
TBT_0_PB_CC2: D?#42.2 J?#10.48(CC2) ; port TBT_0_PB_CC2
TBT_0_PB_RX1_C_DN: C?#220.2 D?#36.2 ; port TBT_0_PB_RX1_C_DN
TBT_0_PB_RX1_C_DP: C?#219.2 D?#35.2 ; port TBT_0_PB_RX1_C_DP
TBT_0_PB_RX1_DN: C?#220.1 J?#10.42(SSRXN1) R?#367.1
TBT_0_PB_RX1_DP: C?#219.1 J?#10.41(SSRXP1) R?#366.1
TBT_0_PB_RX2_C_DN: C?#224.2 D?#38.2 ; port TBT_0_PB_RX2_C_DN
TBT_0_PB_RX2_C_DP: C?#223.2 D?#37.2 ; port TBT_0_PB_RX2_C_DP
TBT_0_PB_RX2_DN: C?#224.1 J?#10.46(SSRXN2) R?#372.1
TBT_0_PB_RX2_DP: C?#223.1 J?#10.45(SSRXP2) R?#371.1
TBT_0_PB_SBU1_CON: C?#217.1 D?#43.2 J?#10.53(SBU1) ; port TBT_0_PA_SBU1_CON  [project net TBT_0_PA_SBU1_CON]
TBT_0_PB_SBU2_CON: C?#218.1 D?#44.2 J?#10.54(SBU2) ; port TBT_0_PA_SBU2_CON  [project net TBT_0_PA_SBU2_CON]
TBT_0_PB_TX1_C_DN: C?#216.2 D?#34.2 ; port TBT_0_PB_TX1_C_DN
TBT_0_PB_TX1_C_DP: C?#215.2 D?#33.2 ; port TBT_0_PB_TX1_C_DP
TBT_0_PB_TX1_DN: C?#216.1 J?#10.40(SSTXN1) R?#365.1
TBT_0_PB_TX1_DP: C?#215.1 J?#10.39(SSTXP1) R?#364.1
TBT_0_PB_TX2_C_DN: C?#222.2 D?#40.2 ; port TBT_0_PB_TX2_C_DN
TBT_0_PB_TX2_C_DP: C?#221.2 D?#39.2 ; port TBT_0_PB_TX2_C_DP
TBT_0_PB_TX2_DN: C?#222.1 J?#10.44(SSTXN2) R?#370.1
TBT_0_PB_TX2_DP: C?#221.1 J?#10.43(SSTXP2) R?#369.1
TBT_0_USB2_PB_DN: D?#45.1 FB?#15.3 J?#10.36(DN1) J?#10.38(DN2) R?#368.2
TBT_0_USB2_PB_DP: D?#46.1 FB?#15.4 J?#10.35(DP1) J?#10.37(DP2) R?#363.2
TBT_0_USB2_PB_R_DN: FB?#15.2 R?#368.1
TBT_0_USB2_PB_R_DP: FB?#15.1 R?#363.1

### Notes on the sheet
- ESDL2011
- PLACE CAPS NEAR USB CONN.
- DESIGN NOTE:
- (near R?#363) USB2.0 CMC+ESD
- (near R?#368) OVERLAPPING FOOTPRINTS
- (near R?#368) DO NOT CHANGE TO 402

### Library data of the parts
C?#210 = Cap: CAP CER 10uF 25V X5R 0201
C?#211-C?#214 = Cap: CAP CER 10000pF 25V X7R 0201
C?#215 C?#216 C?#221 C?#222 = Cap: CAP CER 0.22uF 25V X5R 0201
C?#217 C?#218 = Cap: CAP CER 100pF 50V X7R 0201; DNP: DNP
C?#219 C?#220 C?#223 C?#224 = Cap: CAP CER 0.33uF 25V X5R 0201
D?#32 = SCHOTTKY: Diode, Schottky, 40V, 5A, SMC; ComponentLink1Description: Datasheet link; ComponentLink1URL: http://www.comchip.com.tw/cms/UserFiles/QW-BB012%20CDBC520-G%7E5100-G%20RevC809622.pdf; Manufacturer Part Number: *; Case/Package: *
D?#33 D?#41-D?#44 = ESD5341N: as D?#18 on sheet 0076_TBT_0_PA_CONNECTOR; Case/Package: 0201
  D?#41-D?#44: Manufacturer Part Number: ESD5341N
D?#34-D?#40 D?#45 D?#46 = ESD5341N: as D?#19 on sheet 0076_TBT_0_PA_CONNECTOR; Case/Package: 0201
FB?#15 = WCM3216F2SF-900T04: as FB?#14 on sheet 0076_TBT_0_PA_CONNECTOR; Manufacturer Part Number: WCM3216F2SF-900T04; Case/Package: 3.2x1.6x2mm
R?#363 R?#368 = Res: Thick Film Resistor - 0ohm, 1%, 0603; DNP: DNP
R?#364-R?#367 R?#369-R?#372 = Res: Thick Film Resistor -  220Kohm, 1%, 0201

## Sheet 0082_USB3.SchDoc
size 848 x 558 mm
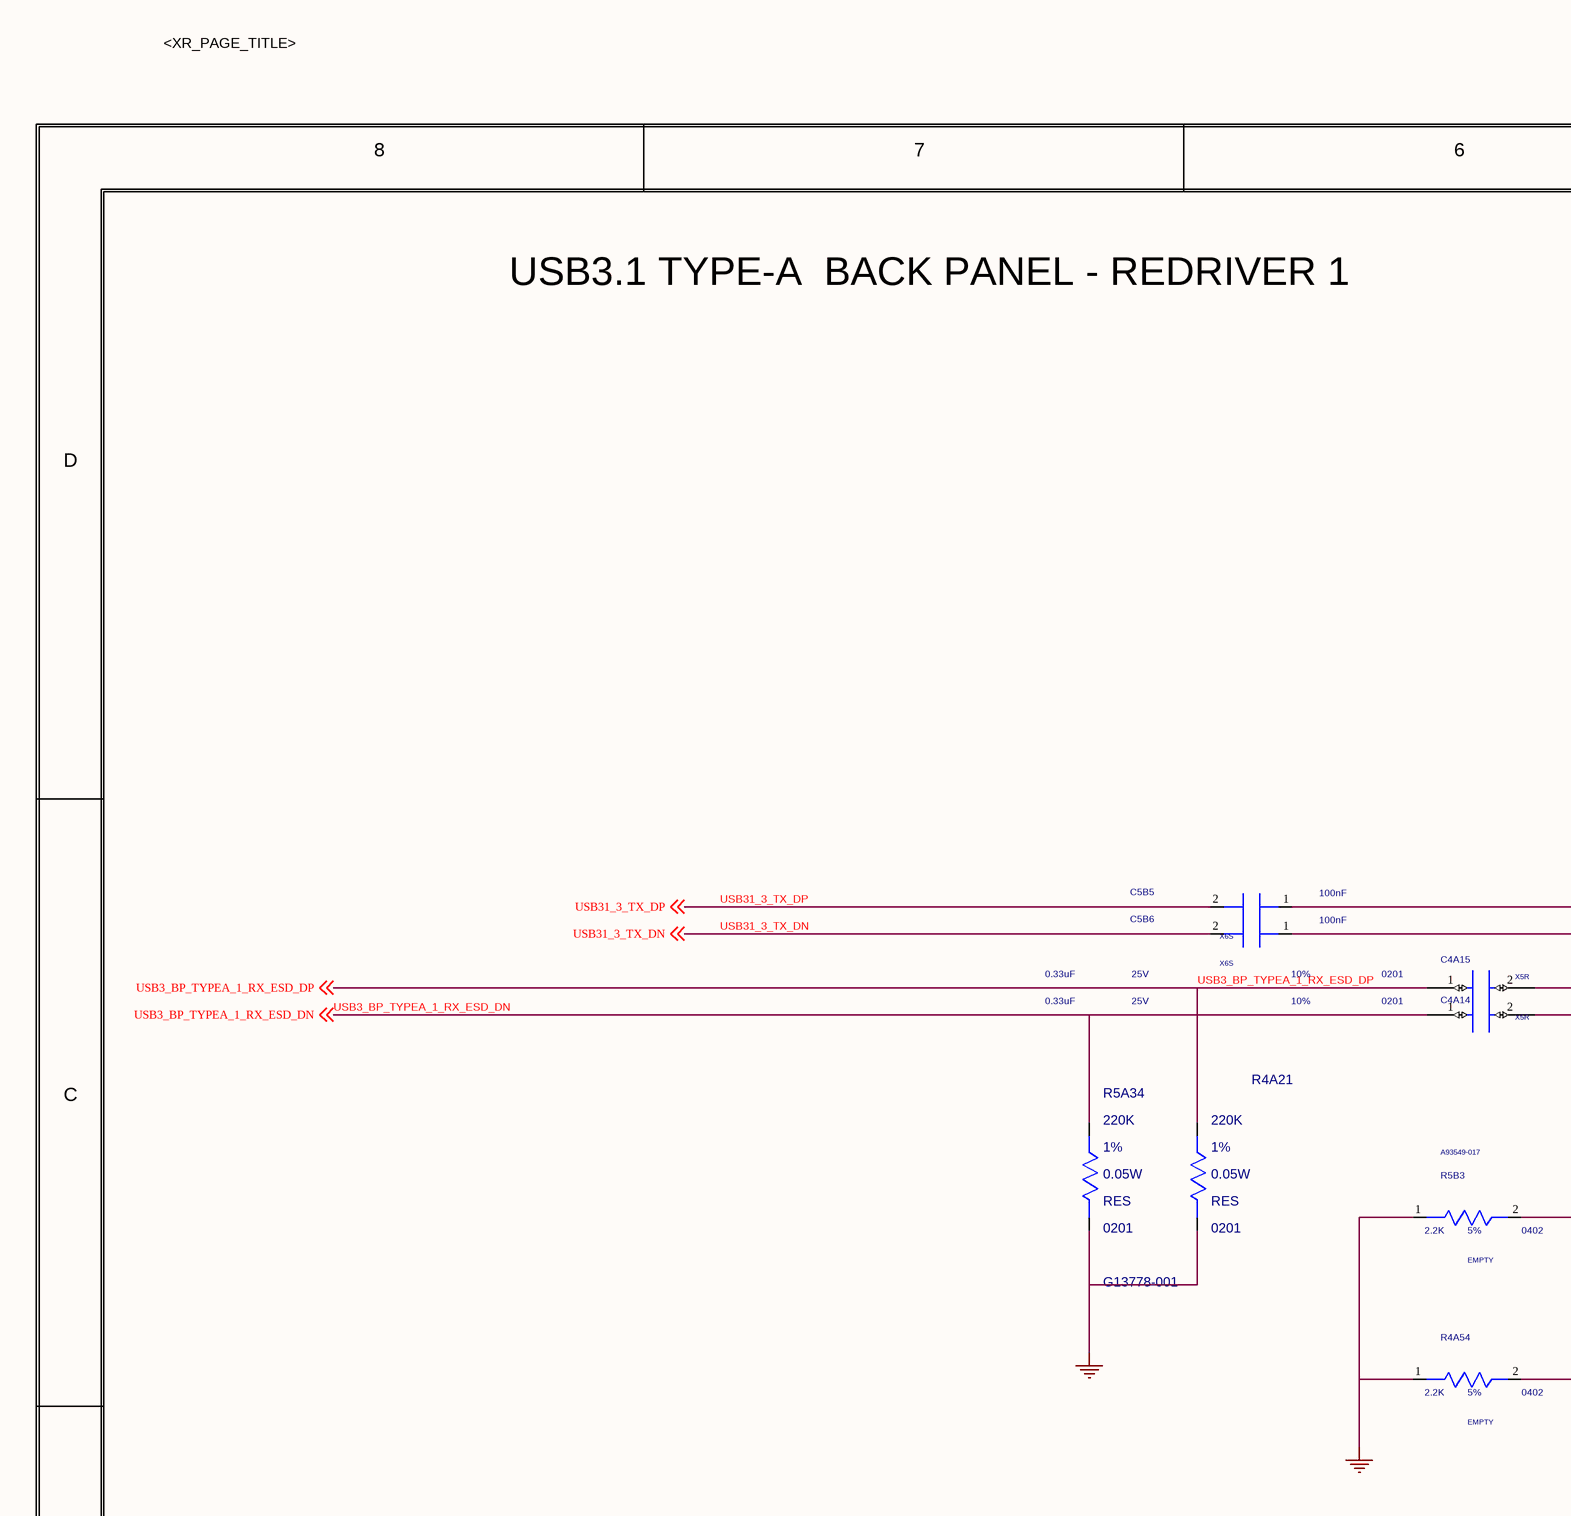
[diagram p130: 0082_USB3.SchDoc, top left]
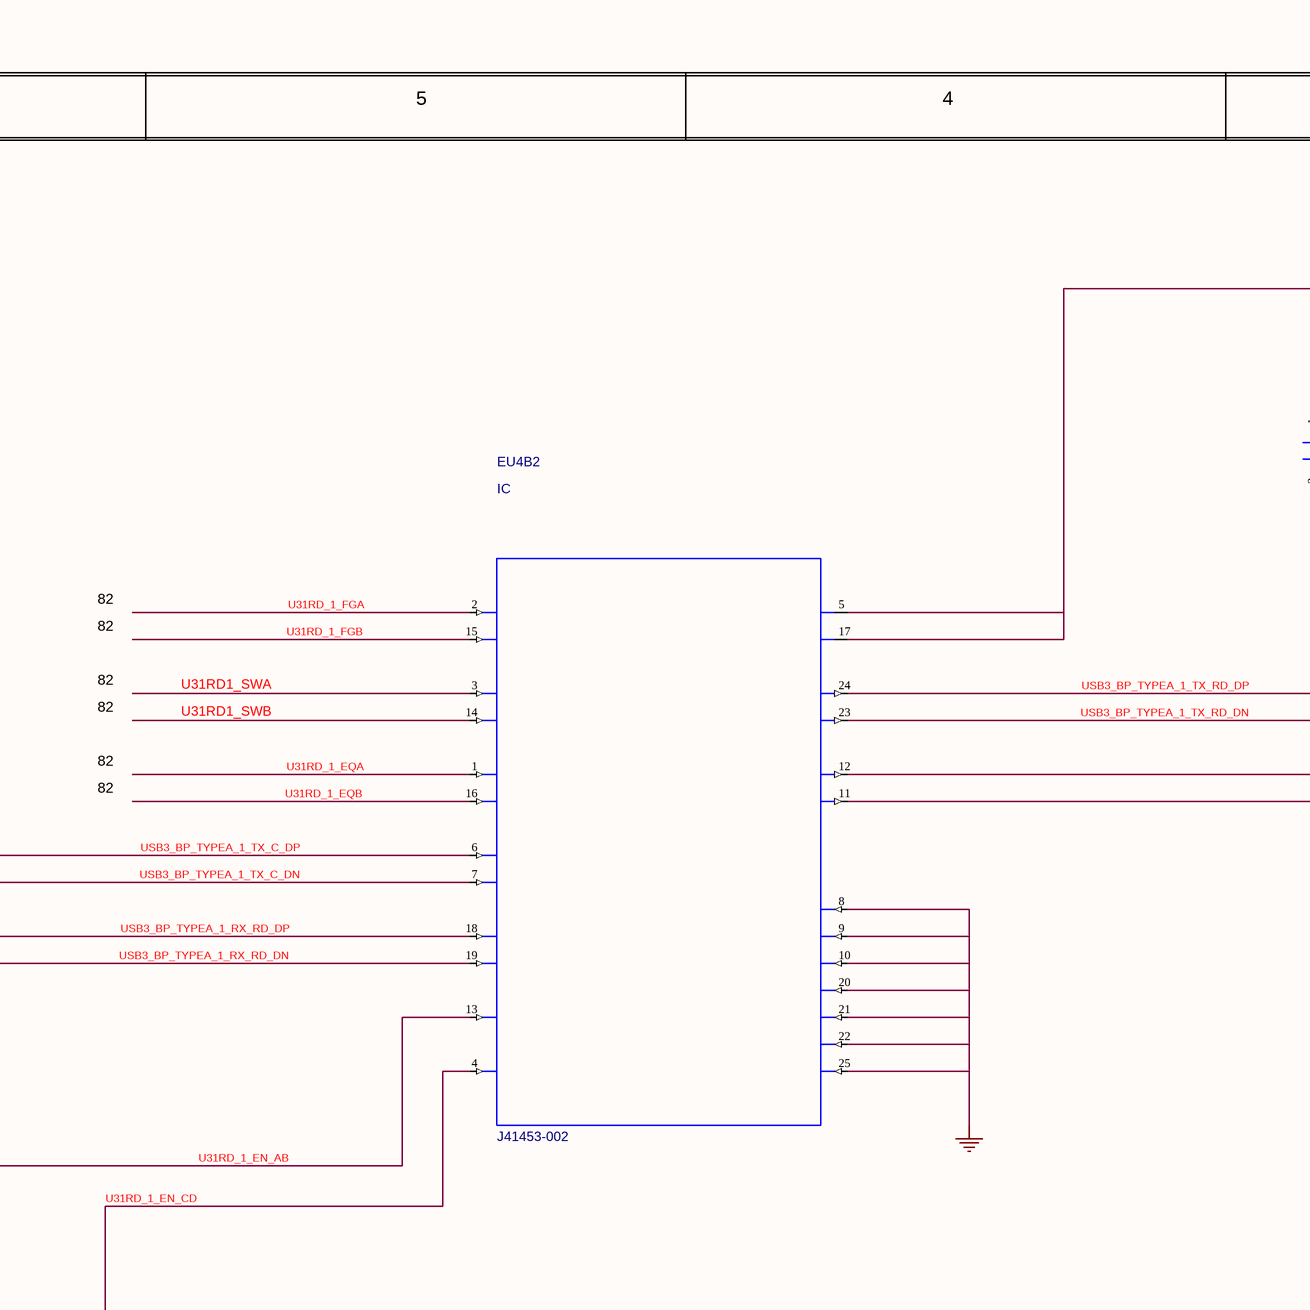
[diagram p131: 0082_USB3.SchDoc, top middle]
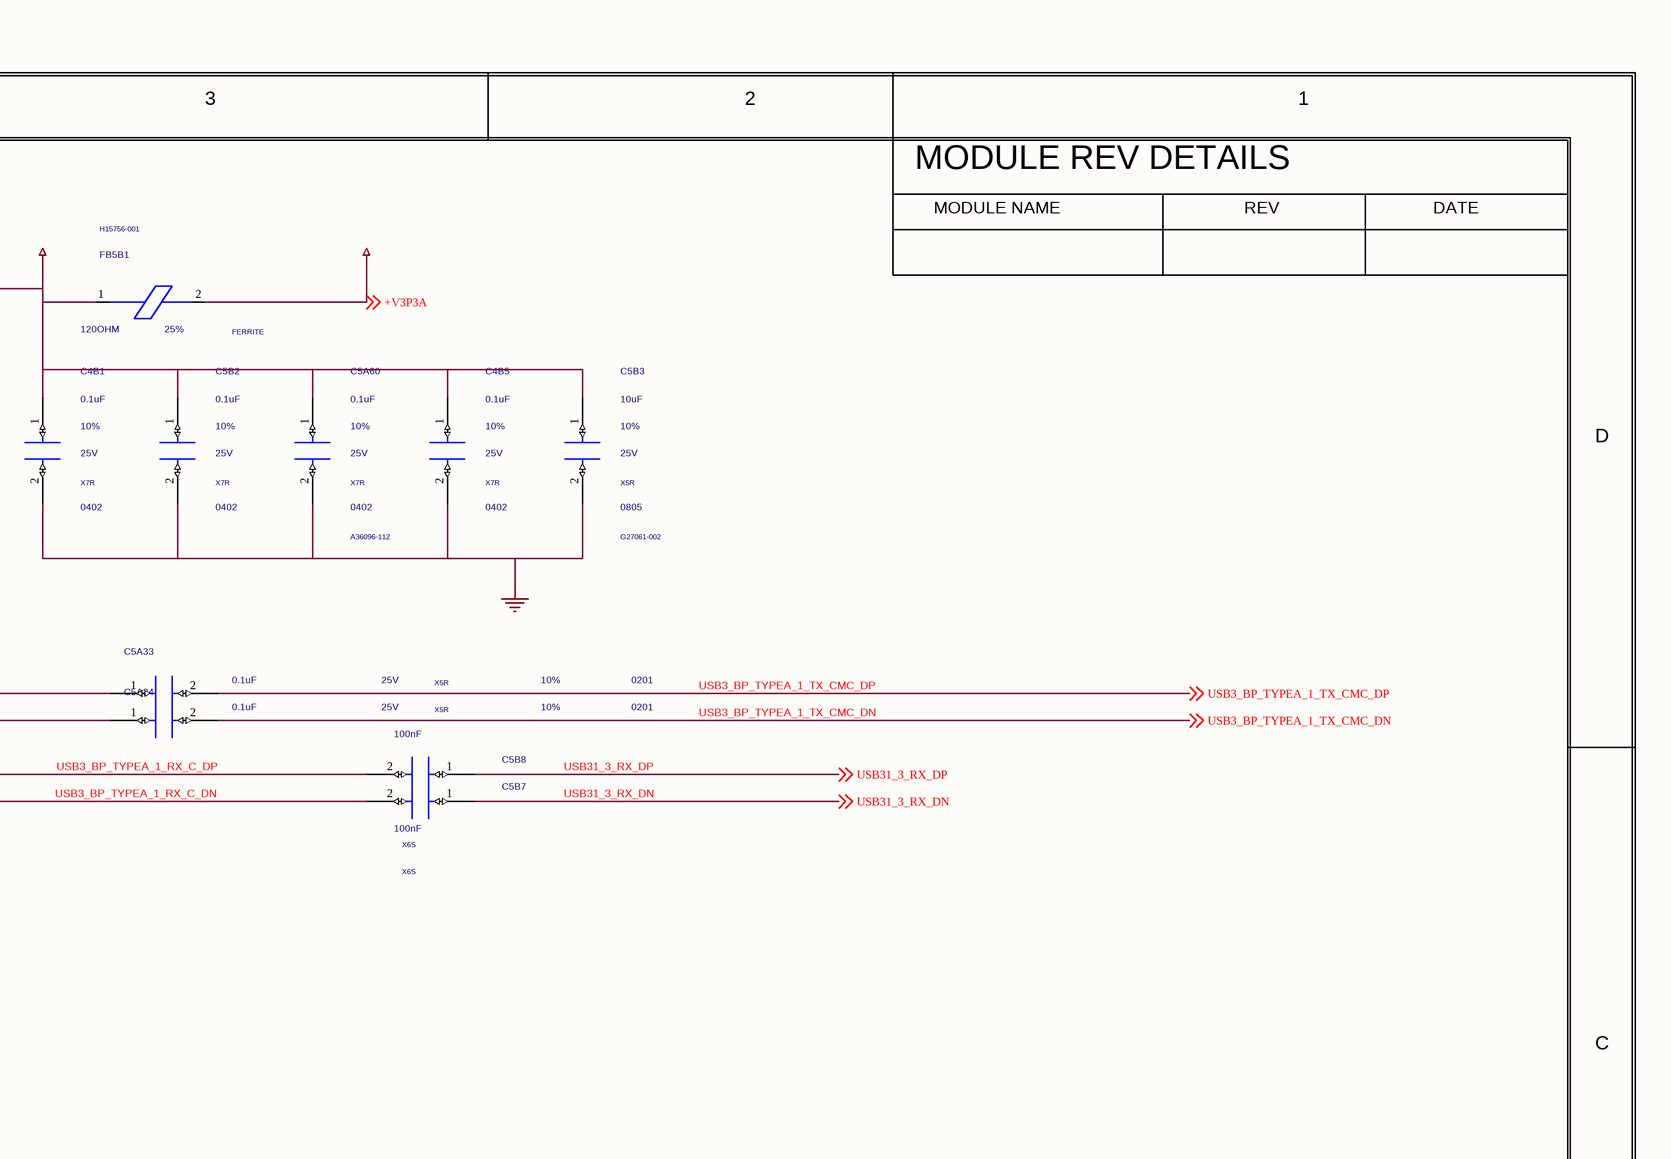
[diagram p132: 0082_USB3.SchDoc, top right]
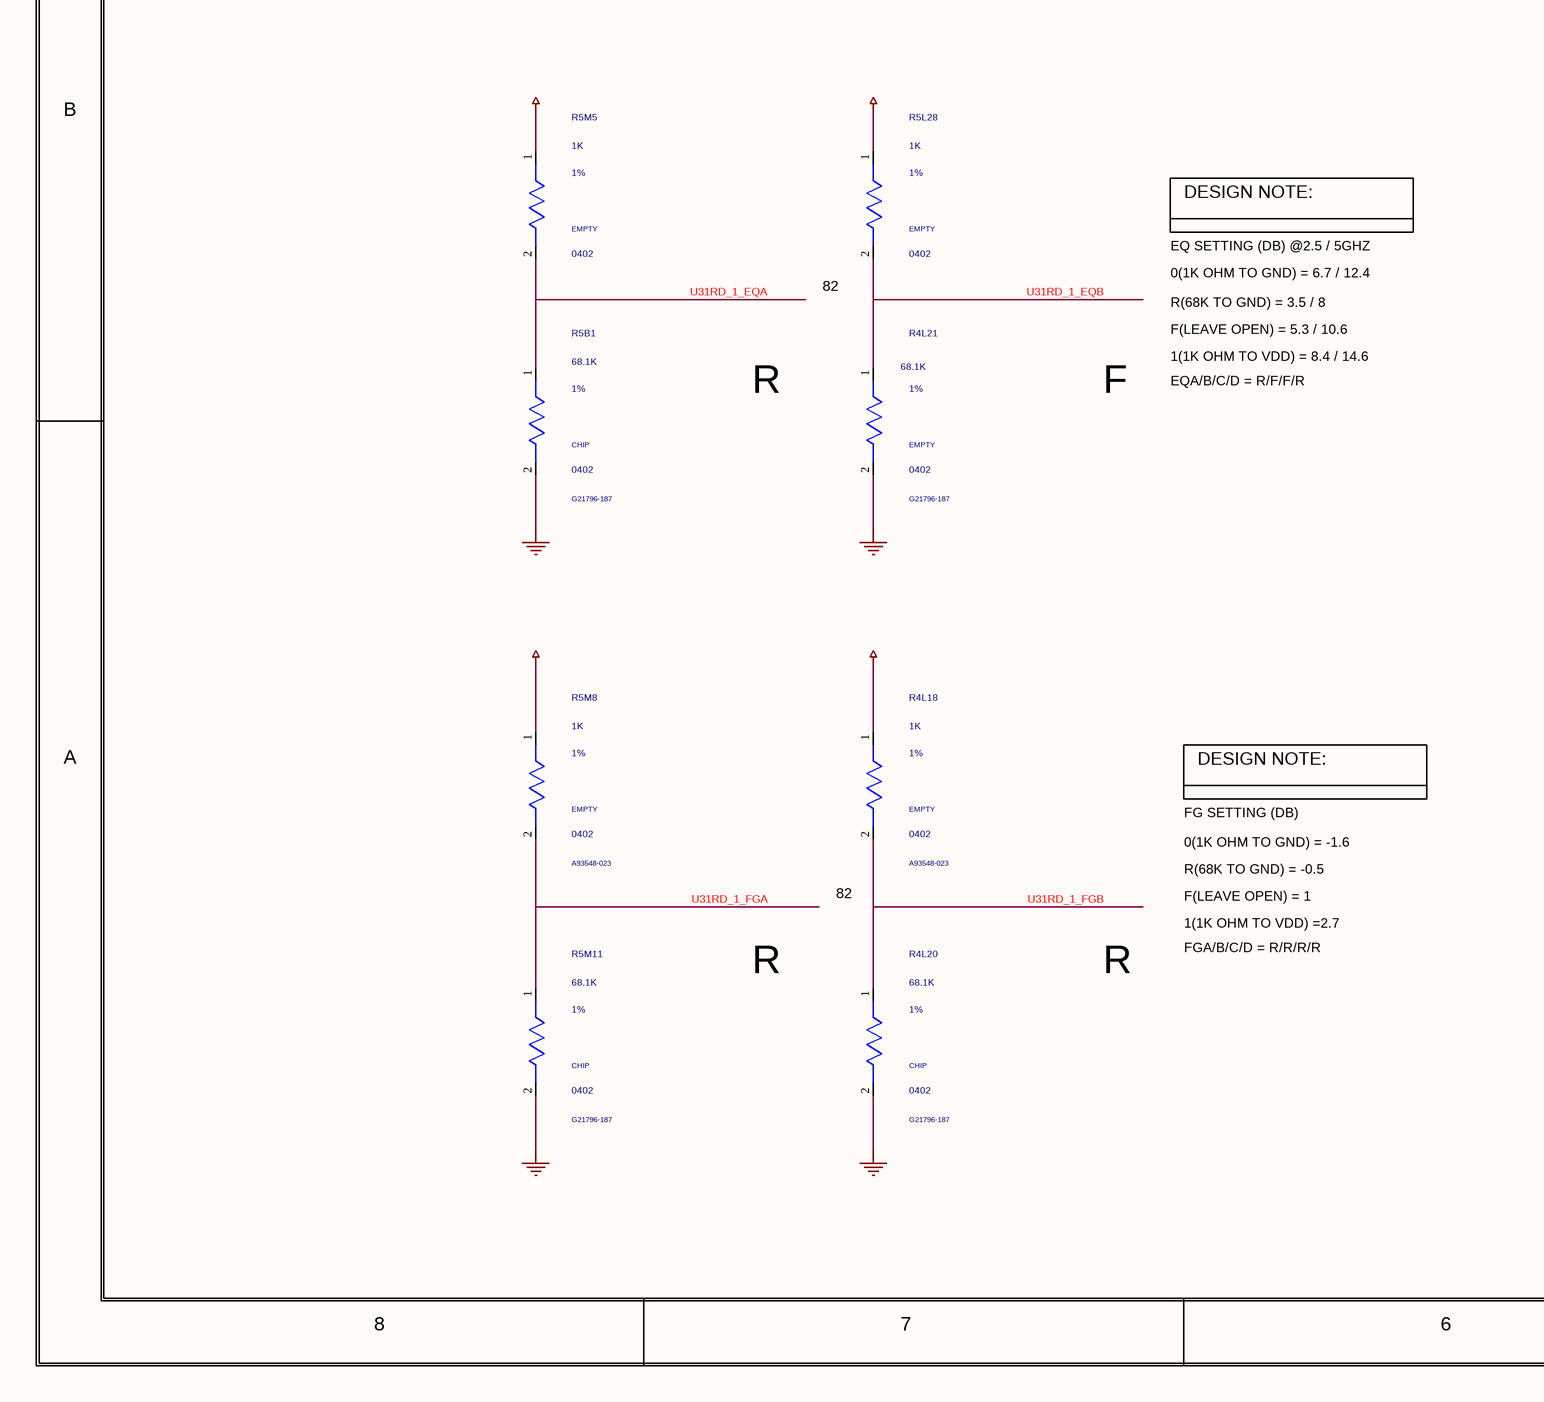
[diagram p133: 0082_USB3.SchDoc, bottom left]
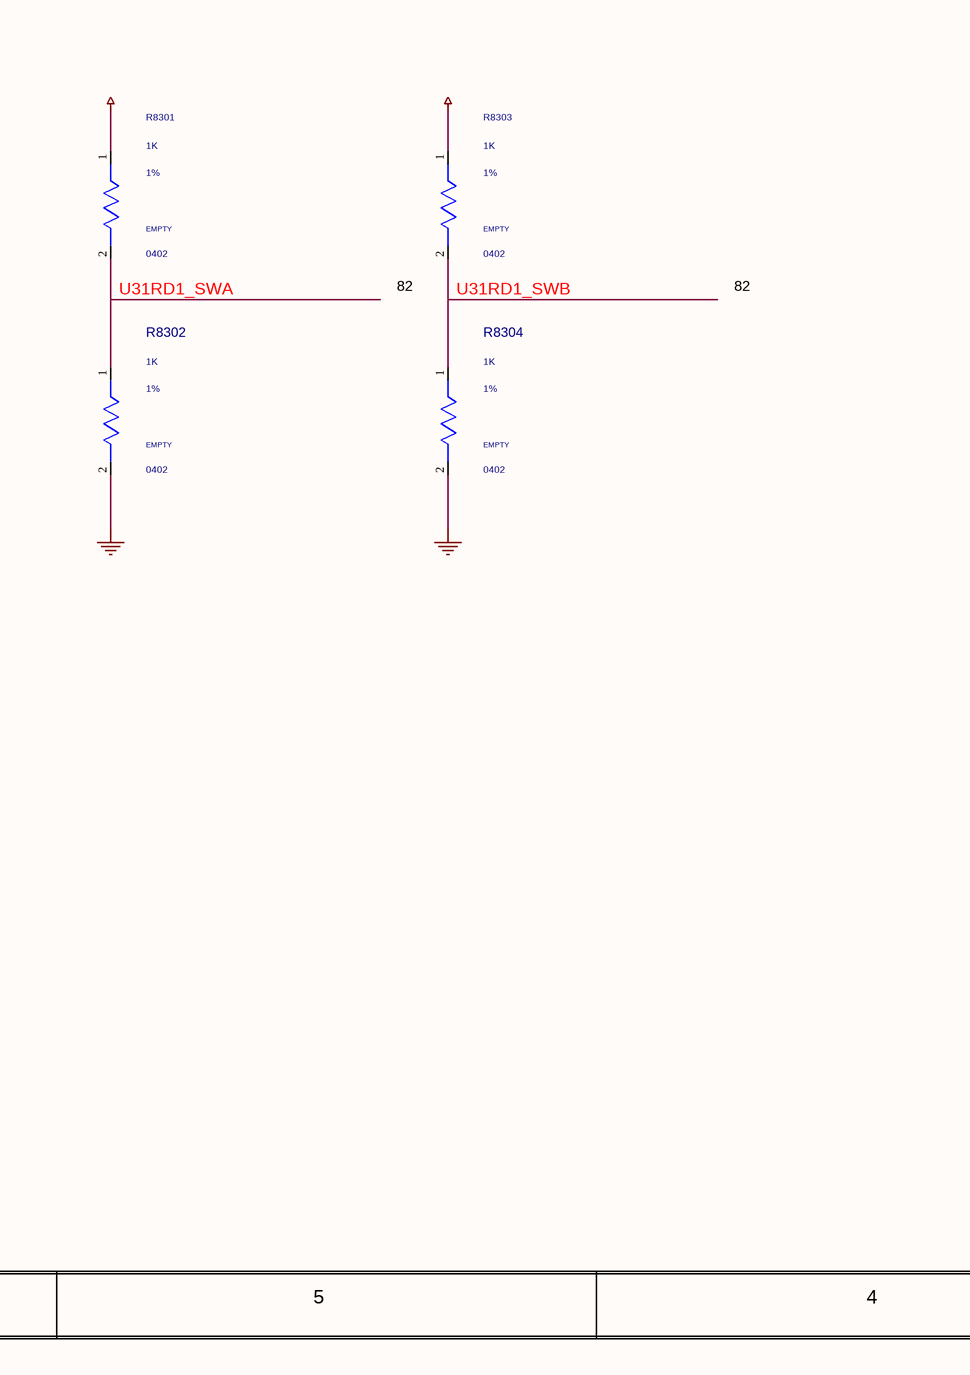
[diagram p134: 0082_USB3.SchDoc, bottom middle]
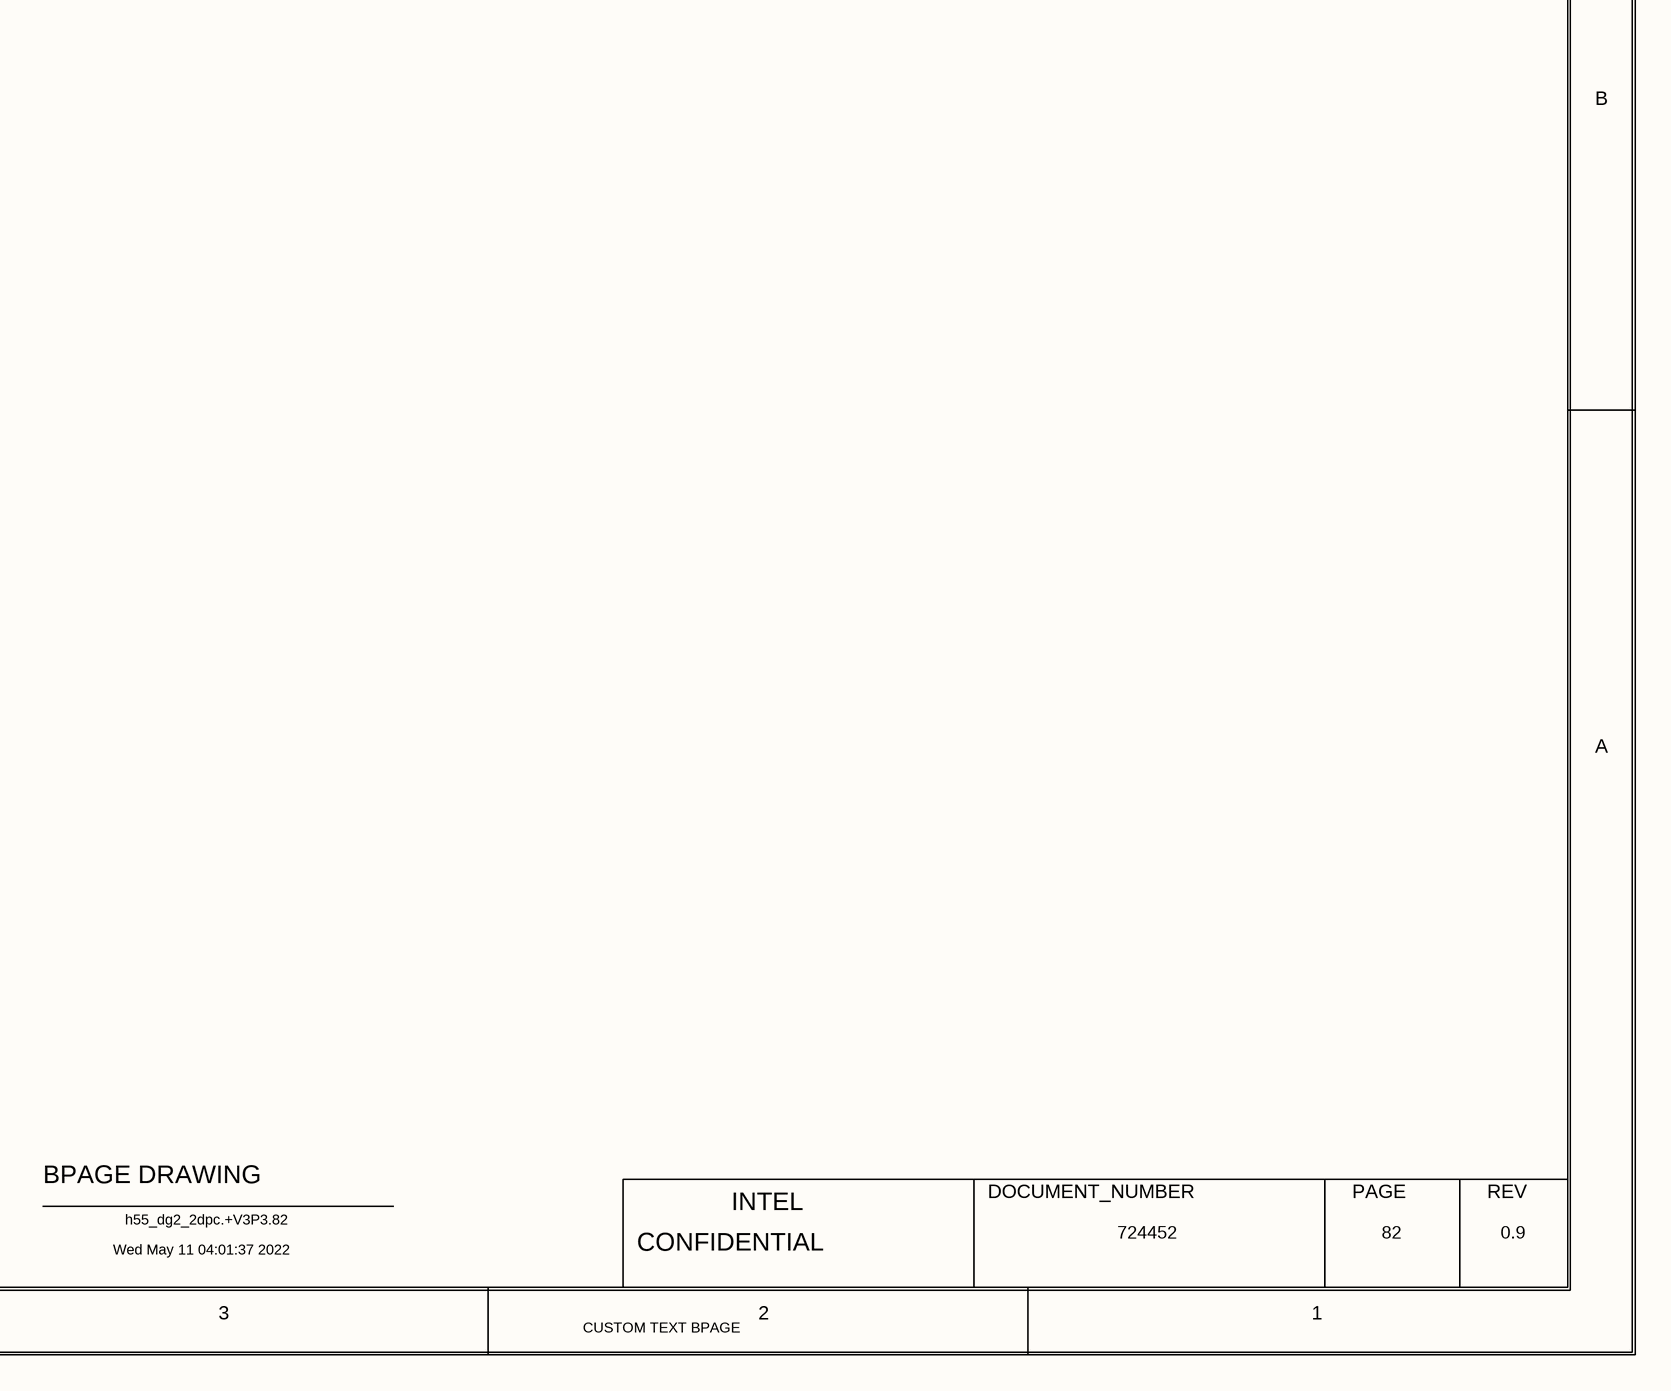
[diagram p135: 0082_USB3.SchDoc, bottom right]

### Parts
C4A14  0.33uF  MATERIAL: X5R  PACK_TYPE: 0201  TOLERANCE: 10%  VOLTAGE: 25V  [SMC0201IA]
C4A15  0.33uF  MATERIAL: X5R  PACK_TYPE: 0201  TOLERANCE: 10%  VOLTAGE: 25V  [SMC0201IA]
C4B1  0.1uF  MATERIAL: X7R  PACK_TYPE: 0402  TOLERANCE: 10%  VOLTAGE: 25V  [SMC0402IA]
C4B5  0.1uF  MATERIAL: X7R  PACK_TYPE: 0402  TOLERANCE: 10%  VOLTAGE: 25V  [SMC0402IA]
C5A33  0.1uF  MATERIAL: X5R  PACK_TYPE: 0201  TOLERANCE: 10%  VOLTAGE: 25V  [SMC0201IA]
C5A34  0.1uF  MATERIAL: X5R  PACK_TYPE: 0201  TOLERANCE: 10%  VOLTAGE: 25V  [SMC0201IA]
C5A60  0.1uF  MATERIAL: X7R  PACK_TYPE: 0402  PART_NUMBER: A36096-112  TOLERANCE: 10%  VOLTAGE: 25V  [SMC0402IA]
C5B2  0.1uF  MATERIAL: X7R  PACK_TYPE: 0402  TOLERANCE: 10%  VOLTAGE: 25V  [SMC0402IA]
C5B3  10uF  MATERIAL: X5R  PACK_TYPE: 0805  PART_NUMBER: G27061-002  TOLERANCE: 10%  VOLTAGE: 25V  [SMC0805MA]
C5B5  100nF  MATERIAL: X6S  [SMC0201IA]
C5B6  100nF  MATERIAL: X6S  [SMC0201IA]
C5B7  100nF  MATERIAL: X6S  [SMC0201IA]
C5B8  100nF  MATERIAL: X6S  [SMC0201IA]
EU4B2  MATERIAL: IC  PART_NUMBER: J41453-002  [CTK2_LCC24_S2550_350_DFS1400_MA]  (hidden comment: C_PI3EQX1002E)
FB5B1  120OHM  PART_NUMBER: H15756-001  TOLERANCE: 25%  [SFB0603IB]
R4A21  220K  MATERIAL: RES  PACK_TYPE: 0201  TOLERANCE: 1%  WATTAGE: 0.05W  [CTK2_SM0201_650X350_MA]
R4A54  2.2K  MATERIAL: EMPTY  PACK_TYPE: 0402  TOLERANCE: 5%  [SMR0402IA]
R4L18  1K  MATERIAL: EMPTY  PACK_TYPE: 0402  PART_NUMBER: A93548-023  TOLERANCE: 1%  [SMR0402IA]
R4L20  68.1K  MATERIAL: CHIP  PACK_TYPE: 0402  PART_NUMBER: G21796-187  TOLERANCE: 1%  [SMR0402IA]
R4L21  68.1K  MATERIAL: EMPTY  PACK_TYPE: 0402  PART_NUMBER: G21796-187  TOLERANCE: 1%  [SMR0402IA]
R5A34  220K  MATERIAL: RES  PACK_TYPE: 0201  PART_NUMBER: G13778-001  TOLERANCE: 1%  WATTAGE: 0.05W  [CTK2_SM0201_650X350_MA]
R5B1  68.1K  MATERIAL: CHIP  PACK_TYPE: 0402  PART_NUMBER: G21796-187  TOLERANCE: 1%  [SMR0402IA]
R5B3  2.2K  MATERIAL: EMPTY  PACK_TYPE: 0402  PART_NUMBER: A93549-017  TOLERANCE: 5%  [SMR0402IA]
R5L28  1K  MATERIAL: EMPTY  PACK_TYPE: 0402  TOLERANCE: 1%  [SMR0402IA]
R5M5  1K  MATERIAL: EMPTY  PACK_TYPE: 0402  TOLERANCE: 1%  [SMR0402IA]
R5M8  1K  MATERIAL: EMPTY  PACK_TYPE: 0402  PART_NUMBER: A93548-023  TOLERANCE: 1%  [SMR0402IA]
R5M11  68.1K  MATERIAL: CHIP  PACK_TYPE: 0402  PART_NUMBER: G21796-187  TOLERANCE: 1%  [SMR0402IA]
R8301  1K  MATERIAL: EMPTY  PACK_TYPE: 0402  TOLERANCE: 1%  [SMR0402IA]
R8302  1K  MATERIAL: EMPTY  PACK_TYPE: 0402  TOLERANCE: 1%  [SMR0402IA]
R8303  1K  MATERIAL: EMPTY  PACK_TYPE: 0402  TOLERANCE: 1%  [SMR0402IA]
R8304  1K  MATERIAL: EMPTY  PACK_TYPE: 0402  TOLERANCE: 1%  [SMR0402IA]

### Nets
+V3P3_DUAL_USBRD_1: C4B1.1(A) C4B5.1(A) C5A60.1(A) C5B2.1(A) C5B3.1(A) EU4B2.5(VDD_1) EU4B2.17(VDD_2) FB5B1.1(A) R4L18.1(A) R5L28.1(A) R5M5.1(A) R5M8.1(A) R8301.1(A) R8303.1(A)
+V3P3A: FB5B1.2(B) ; off-sheet +V3P3A
GND: C4B1.2(B) C4B5.2(B) C5A60.2(B) C5B2.2(B) C5B3.2(B) EU4B2.8(GND_1) EU4B2.9(GND_2) EU4B2.10(GND_3) EU4B2.20(GND_4) EU4B2.21(GND_5) EU4B2.22(GND_6) EU4B2.25(GND_TPD) R4A21.2(B) R4A54.1(A) R4L20.2(B) R4L21.2(B) R5A34.2(B) R5B1.2(B) R5B3.1(A) R5M11.2(B) R8302.2(B) R8304.2(B)  [project net EXP_A_RX_4_DP]
U31RD1_SWA: EU4B2.3(SWA) R8301.2(B) R8302.1(A)
U31RD1_SWB: EU4B2.14(SWB) R8303.2(B) R8304.1(A)
U31RD_1_EN_AB: EU4B2.13(RXDET_EN) R5B3.2(B)
U31RD_1_EN_CD: EU4B2.4(EN) R4A54.2(B)
U31RD_1_EQA: EU4B2.1(EQA) R5B1.1(A) R5M5.2(B)
U31RD_1_EQB: EU4B2.16(EQB) R4L21.1(A) R5L28.2(B)
U31RD_1_FGA: EU4B2.2(FGA) R5M8.2(B) R5M11.1(A)
U31RD_1_FGB: EU4B2.15(FGB) R4L18.2(B) R4L20.1(A)
USB3_BP_TYPEA_1_RX_C_DN: C5B7.2(B) EU4B2.11(BON)
USB3_BP_TYPEA_1_RX_C_DP: C5B8.2(B) EU4B2.12(BOP)
USB3_BP_TYPEA_1_RX_ESD_DN: C4A14.1(A) R5A34.1(A) ; off-sheet USB3_BP_TYPEA_1_RX_ESD_DN
USB3_BP_TYPEA_1_RX_ESD_DP: C4A15.1(A) R4A21.1(A) ; off-sheet USB3_BP_TYPEA_1_RX_ESD_DP
USB3_BP_TYPEA_1_RX_RD_DN: C4A14.2(B) EU4B2.19(BIN)
USB3_BP_TYPEA_1_RX_RD_DP: C4A15.2(B) EU4B2.18(BIP)
USB3_BP_TYPEA_1_TX_C_DN: C5B6.1(A) EU4B2.7(AIN)
USB3_BP_TYPEA_1_TX_C_DP: C5B5.1(A) EU4B2.6(AIP)
USB3_BP_TYPEA_1_TX_CMC_DN: C5A34.2(B) ; off-sheet USB3_BP_TYPEA_1_TX_CMC_DN
USB3_BP_TYPEA_1_TX_CMC_DP: C5A33.2(B) ; off-sheet USB3_BP_TYPEA_1_TX_CMC_DP
USB3_BP_TYPEA_1_TX_RD_DN: C5A34.1(A) EU4B2.23(AON)
USB3_BP_TYPEA_1_TX_RD_DP: C5A33.1(A) EU4B2.24(AOP)
USB31_3_RX_DN: C5B7.1(A) ; off-sheet USB31_3_RX_DN
USB31_3_RX_DP: C5B8.1(A) ; off-sheet USB31_3_RX_DP
USB31_3_TX_DN: C5B6.2(B) ; off-sheet USB31_3_TX_DN
USB31_3_TX_DP: C5B5.2(B) ; off-sheet USB31_3_TX_DP

### Notes on the sheet
- <XR_PAGE_TITLE>
- 8
- 7
- 6
- 5
- 4
- 3
- 2
- 1
- MODULE REV DETAILS
- USB3.1 TYPE-A  BACK PANEL - REDRIVER 1
- MODULE NAME
- REV
- DATE
- D
- 82
- C
- B
- DESIGN NOTE:
- EQ SETTING (DB) @2.5 / 5GHZ
- 0(1K OHM TO GND) = 6.7 / 12.4
- (near R5L28) 82
- R(68K TO GND) = 3.5 / 8
- F(LEAVE OPEN) = 5.3 / 10.6
- (near R8303) 82
- R
- F
- 1(1K OHM TO VDD) = 8.4 / 14.6
- EQA/B/C/D = R/F/F/R
- A
- FG SETTING (DB)
- R(68K TO GND) = -0.5
- 0(1K OHM TO GND) = -1.6
- F(LEAVE OPEN) = 1
- 1(1K OHM TO VDD) =2.7
- FGA/B/C/D = R/R/R/R
- BPAGE DRAWING
- INTEL
- DOCUMENT_NUMBER
- PAGE
- Wed May 11 04:01:37 2022
- h55_dg2_2dpc.+V3P3.82
- CONFIDENTIAL
- 724452
- 0.9
- CUSTOM TEXT BPAGE

### Library data of the parts
C4A14 = CAP#1: PART_NUMBER: J96611-001; CHIPS_PART_NAME: CAP; CDS_PHYS_PART_NAME: CAP_0201-J96611-001,X5R,0.33UF,25V,10%,LPDB,GENERIC; OriginalSymbolOrigin: (-25,50); XY: (-5450,3475); VER: 2; ROT: 0; PHYS_PAGE: 82; LOCATION: C4A14; IP: GENERIC; FP_TECH: LPDB; DRAWING: @RVP1_ADL_SB_ADP_S_DDR5_SODIMM_2DPC_LIB.H55_DG2_2DPC(SCH_1):PAGE454; CDS_LIB: discrete; PCB Footprint: SMC0201IA; SEC_TYPE: 0201; CDS_PART_NAME: CAP_0201-J96611-001,X5R,0.33UF,25V,10%,LPDB,GENERIC; CDS_LOCATION: C4A14; ASI_MODEL: J96611-001
C4A15 = CAP#1: PART_NUMBER: J96611-001; CHIPS_PART_NAME: CAP; CDS_PHYS_PART_NAME: CAP_0201-J96611-001,X5R,0.33UF,25V,10%,LPDB,GENERIC; OriginalSymbolOrigin: (-25,50); XY: (-5450,3525); VER: 2; ROT: 0; PHYS_PAGE: 82; LOCATION: C4A15; IP: GENERIC; FP_TECH: LPDB; DRAWING: @RVP1_ADL_SB_ADP_S_DDR5_SODIMM_2DPC_LIB.H55_DG2_2DPC(SCH_1):PAGE454; CDS_LIB: discrete; PCB Footprint: SMC0201IA; SEC_TYPE: 0201; CDS_PART_NAME: CAP_0201-J96611-001,X5R,0.33UF,25V,10%,LPDB,GENERIC; CDS_LOCATION: C4A15; ASI_MODEL: J96611-001
C4B1 = CAP: PART_NUMBER: A36096-112; CDS_PHYS_PART_NAME: CAP_0402-A36096-112,X7R,0.1UF,25V,10%,LPDB,GENERIC; OriginalSymbolOrigin: (-50,25); XY: (-2825,4425); VER: 1; ROT: 0; PHYS_PAGE: 82; LOCATION: C4B1; IP: GENERIC; FP_TECH: LPDB; DRAWING: @RVP1_ADL_SB_ADP_S_DDR5_SODIMM_2DPC_LIB.H55_DG2_2DPC(SCH_1):PAGE454; CDS_LIB: discrete; PCB Footprint: SMC0402IA; CHIPS_PART_NAME: CAP; CDS_PART_NAME: CAP_0402-A36096-112,X7R,0.1UF,25V,10%,LPDB,GENERIC; CDS_LOCATION: C4B1; ASI_MODEL: A36096-112
C4B5 = CAP: PART_NUMBER: A36096-112; CDS_PHYS_PART_NAME: CAP_0402-A36096-112,X7R,0.1UF,25V,10%,LPDB,GENERIC; OriginalSymbolOrigin: (-50,25); XY: (-2075,4425); VER: 1; ROT: 0; PHYS_PAGE: 82; LOCATION: C4B5; IP: GENERIC; FP_TECH: LPDB; DRAWING: @RVP1_ADL_SB_ADP_S_DDR5_SODIMM_2DPC_LIB.H55_DG2_2DPC(SCH_1):PAGE454; CDS_LIB: discrete; PCB Footprint: SMC0402IA; CHIPS_PART_NAME: CAP; CDS_PART_NAME: CAP_0402-A36096-112,X7R,0.1UF,25V,10%,LPDB,GENERIC; CDS_LOCATION: C4B5; ASI_MODEL: A36096-112
C5A33 = CAP#1: PART_NUMBER: C83410-027; CHIPS_PART_NAME: CAP; CDS_PHYS_PART_NAME: CAP_0201-C83410-027,X5R,0.1UF,25V,10%,LPDB,GENERIC; OriginalSymbolOrigin: (-25,50); XY: (-2600,3975); VER: 2; ROT: 0; PHYS_PAGE: 82; LOCATION: C5A33; IP: GENERIC; FP_TECH: LPDB; DRAWING: @RVP1_ADL_SB_ADP_S_DDR5_SODIMM_2DPC_LIB.H55_DG2_2DPC(SCH_1):PAGE454; CDS_LIB: discrete; PCB Footprint: SMC0201IA; SEC_TYPE: 0201; CDS_PART_NAME: CAP_0201-C83410-027,X5R,0.1UF,25V,10%,LPDB,GENERIC; CDS_LOCATION: C5A33; ASI_MODEL: C83410-027
C5A34 = CAP#1: PART_NUMBER: C83410-027; CHIPS_PART_NAME: CAP; CDS_PHYS_PART_NAME: CAP_0201-C83410-027,X5R,0.1UF,25V,10%,LPDB,GENERIC; OriginalSymbolOrigin: (-25,50); XY: (-2600,3925); VER: 2; ROT: 0; PHYS_PAGE: 82; LOCATION: C5A34; IP: GENERIC; FP_TECH: LPDB; DRAWING: @RVP1_ADL_SB_ADP_S_DDR5_SODIMM_2DPC_LIB.H55_DG2_2DPC(SCH_1):PAGE454; CDS_LIB: discrete; PCB Footprint: SMC0201IA; SEC_TYPE: 0201; CDS_PART_NAME: CAP_0201-C83410-027,X5R,0.1UF,25V,10%,LPDB,GENERIC; CDS_LOCATION: C5A34; ASI_MODEL: C83410-027
C5A60 = CAP: CDS_PHYS_PART_NAME: CAP_0402-A36096-112,X7R,0.1UF,25V,10%,LPDB,GENERIC; OriginalSymbolOrigin: (-50,25); XY: (-2325,4425); VER: 1; ROT: 0; PHYS_PAGE: 82; LOCATION: C5A60; IP: GENERIC; FP_TECH: LPDB; DRAWING: @RVP1_ADL_SB_ADP_S_DDR5_SODIMM_2DPC_LIB.H55_DG2_2DPC(SCH_1):PAGE454; CDS_LIB: discrete; PCB Footprint: SMC0402IA; CHIPS_PART_NAME: CAP; CDS_PART_NAME: CAP_0402-A36096-112,X7R,0.1UF,25V,10%,LPDB,GENERIC; CDS_LOCATION: C5A60; ASI_MODEL: A36096-112
C5B2 = CAP: PART_NUMBER: A36096-112; CDS_PHYS_PART_NAME: CAP_0402-A36096-112,X7R,0.1UF,25V,10%,LPDB,GENERIC; OriginalSymbolOrigin: (-50,25); XY: (-2575,4425); VER: 1; ROT: 0; PHYS_PAGE: 82; LOCATION: C5B2; IP: GENERIC; FP_TECH: LPDB; DRAWING: @RVP1_ADL_SB_ADP_S_DDR5_SODIMM_2DPC_LIB.H55_DG2_2DPC(SCH_1):PAGE454; CDS_LIB: discrete; PCB Footprint: SMC0402IA; CHIPS_PART_NAME: CAP; CDS_PART_NAME: CAP_0402-A36096-112,X7R,0.1UF,25V,10%,LPDB,GENERIC; CDS_LOCATION: C5B2; ASI_MODEL: A36096-112
C5B3 = CAP: CDS_PHYS_PART_NAME: CAP_0805-G27061-002,X5R,10UF,25V,10%,LPDB,GENERIC; OriginalSymbolOrigin: (-50,25); XY: (-1825,4425); VER: 1; ROT: 0; PHYS_PAGE: 82; LOCATION: C5B3; IP: GENERIC; FP_TECH: LPDB; DRAWING: @RVP1_ADL_SB_ADP_S_DDR5_SODIMM_2DPC_LIB.H55_DG2_2DPC(SCH_1):PAGE454; CDS_LIB: discrete; PCB Footprint: SMC0805MA; CHIPS_PART_NAME: CAP; CDS_PART_NAME: CAP_0805-G27061-002,X5R,10UF,25V,10%,LPDB,GENERIC; CDS_LOCATION: C5B3; ASI_MODEL: G27061-002
C5B5 = CAP#2: PART_NUMBER: H68299-001; CHIPS_PART_NAME: CAP; CDS_PHYS_PART_NAME: CAP_0201-H68299-001,X6S,100NF,25V,10%,LPDB,GENERIC; PACK_TYPE: 0201; TOLERANCE: 10%; VOLTAGE: 25V; OriginalSymbolOrigin: (-75,25); XY: (-5900,3675); VER: 4; ROT: 2; PHYS_PAGE: 82; LOCATION: C5B5; IP: GENERIC; FP_TECH: LPDB; DRAWING: @RVP1_ADL_SB_ADP_S_DDR5_SODIMM_2DPC_LIB.H55_DG2_2DPC(SCH_1):PAGE454; CDS_LIB: discrete; PCB Footprint: SMC0201IA; SEC_TYPE: 0201; CDS_PART_NAME: CAP_0201-H68299-001,X6S,100NF,25V,10%,LPDB,GENERIC; CDS_LOCATION: C5B5; ASI_MODEL: H68299-001
C5B6 = CAP#2: PART_NUMBER: H68299-001; CHIPS_PART_NAME: CAP; CDS_PHYS_PART_NAME: CAP_0201-H68299-001,X6S,100NF,25V,10%,LPDB,GENERIC; PACK_TYPE: 0201; TOLERANCE: 10%; VOLTAGE: 25V; OriginalSymbolOrigin: (-75,25); XY: (-5900,3625); VER: 4; ROT: 2; PHYS_PAGE: 82; LOCATION: C5B6; IP: GENERIC; FP_TECH: LPDB; DRAWING: @RVP1_ADL_SB_ADP_S_DDR5_SODIMM_2DPC_LIB.H55_DG2_2DPC(SCH_1):PAGE454; CDS_LIB: discrete; PCB Footprint: SMC0201IA; SEC_TYPE: 0201; CDS_PART_NAME: CAP_0201-H68299-001,X6S,100NF,25V,10%,LPDB,GENERIC; CDS_LOCATION: C5B6; ASI_MODEL: H68299-001
C5B7 = CAP#1: PART_NUMBER: H68299-001; CHIPS_PART_NAME: CAP; CDS_PHYS_PART_NAME: CAP_0201-H68299-001,X6S,100NF,25V,10%,LPDB,GENERIC; PACK_TYPE: 0201; TOLERANCE: 10%; VOLTAGE: 25V; OriginalSymbolOrigin: (-25,50); XY: (-2125,3775); VER: 2; PHYS_PAGE: 82; LOCATION: C5B7; IP: GENERIC; FP_TECH: LPDB; DRAWING: @RVP1_ADL_SB_ADP_S_DDR5_SODIMM_2DPC_LIB.H55_DG2_2DPC(SCH_1):PAGE454; CDS_LIB: discrete; PCB Footprint: SMC0201IA; SEC_TYPE: 0201; ROT: 2; CDS_PART_NAME: CAP_0201-H68299-001,X6S,100NF,25V,10%,LPDB,GENERIC; CDS_LOCATION: C5B7; ASI_MODEL: H68299-001
C5B8 = CAP#1: PART_NUMBER: H68299-001; CHIPS_PART_NAME: CAP; CDS_PHYS_PART_NAME: CAP_0201-H68299-001,X6S,100NF,25V,10%,LPDB,GENERIC; PACK_TYPE: 0201; TOLERANCE: 10%; VOLTAGE: 25V; OriginalSymbolOrigin: (-25,50); XY: (-2125,3825); VER: 2; PHYS_PAGE: 82; LOCATION: C5B8; IP: GENERIC; FP_TECH: LPDB; DRAWING: @RVP1_ADL_SB_ADP_S_DDR5_SODIMM_2DPC_LIB.H55_DG2_2DPC(SCH_1):PAGE454; CDS_LIB: discrete; PCB Footprint: SMC0201IA; SEC_TYPE: 0201; ROT: 2; CDS_PART_NAME: CAP_0201-H68299-001,X6S,100NF,25V,10%,LPDB,GENERIC; CDS_LOCATION: C5B8; ASI_MODEL: H68299-001
EU4B2 = C_PI3EQX1002E: CDS_PHYS_PART_NAME: C_PI3EQX1002E_LCC-J41453-002,IC,PI3EQX1002E2ZREX,TK2,GENERIC; CDS_LMAN_SYM_OUTLINE: -300,550,300,-500; FP_TECH: TK2; IP: GENERIC; PACK_TYPE: LCC; ROOM: NONE; OriginalSymbolOrigin: (-325,550); XY: (-4050,3675); VER: 1; ROT: 0; PHYS_PAGE: 82; LOCATION: EU4B2; DRAWING: @RVP1_ADL_SB_ADP_S_DDR5_SODIMM_2DPC_LIB.H55_DG2_2DPC(SCH_1):PAGE454; CDS_LIB: local; VARIANT: ?; PCB Footprint: CTK2_LCC24_S2550_350_DFS1400_MA; CHIPS_PART_NAME: C_PI3EQX1002E; CDS_PART_NAME: C_PI3EQX1002E_LCC-J41453-002,IC,PI3EQX1002E2ZREX,TK2,GENERIC; CDS_LOCATION: EU4B2
FB5B1 = FERRITE: CDS_PHYS_PART_NAME: FERRITE_0603-H15756-001,FERRITE,120OHM,25%,3A,LPDB,GENERIC; CURRENT: 3A; PACK_TYPE: 0603; OriginalSymbolOrigin: (-75,50); XY: (-2625,4700); VER: 1; ROT: 0; PHYS_PAGE: 82; LOCATION: FB5B1; IP: GENERIC; FP_TECH: LPDB; DRAWING: @RVP1_ADL_SB_ADP_S_DDR5_SODIMM_2DPC_LIB.H55_DG2_2DPC(SCH_1):PAGE454; CDS_LIB: discrete; MATERIAL: FERRITE; PCB Footprint: SFB0603IB; SEC_TYPE: 0603; CHIPS_PART_NAME: FERRITE; CDS_PART_NAME: FERRITE_0603-H15756-001,FERRITE,120OHM,25%,3A,LPDB,GENERIC; CDS_LOCATION: FB5B1
R4A21 = C_RES: PART_NUMBER: G13778-001; CDS_PHYS_PART_NAME: C_RES_0201-G13778-001,RES,220K,1%,0.05W,TK2,GENERIC; CDS_LMAN_SYM_OUTLINE: -50,50,50,-50; FP_TECH: TK2; IP: GENERIC; ROOM: NONE; OriginalSymbolOrigin: (-25,75); XY: (-5975,3175); VER: 2; ROT: 0; PHYS_PAGE: 82; LOCATION: R4A21; DRAWING: @RVP1_ADL_SB_ADP_S_DDR5_SODIMM_2DPC_LIB.H55_DG2_2DPC(SCH_1):PAGE454; CDS_LIB: c_discrete; VARIANT: ?; PCB Footprint: CTK2_SM0201_650X350_MA; CHIPS_PART_NAME: C_RES; CDS_PART_NAME: C_RES_0201-G13778-001,RES,220K,1%,0.05W,TK2,GENERIC; CDS_LOCATION: R4A21
R4A54 = RES#1: PART_NUMBER: A93549-017; CHIPS_PART_NAME: RES; CDS_PHYS_PART_NAME: RES_0402-A93549-017,EMPTY,2.2K,5%,1/16W,LPDB,GENERIC; WATTAGE: 1/16W; OriginalSymbolOrigin: (-75,25); XY: (-5475,2800); VER: 1; ROT: 0; PHYS_PAGE: 82; LOCATION: R4A54; IP: GENERIC; FP_TECH: LPDB; DRAWING: @RVP1_ADL_SB_ADP_S_DDR5_SODIMM_2DPC_LIB.H55_DG2_2DPC(SCH_1):PAGE454; CDS_LIB: discrete; PCB Footprint: SMR0402IA; SEC_TYPE: 0402; CDS_PART_NAME: RES_0402-A93549-017,EMPTY,2.2K,5%,1/16W,LPDB,GENERIC; CDS_LOCATION: R4A54; ASI_MODEL: A93549-017
R4L18 = RES: CDS_PHYS_PART_NAME: RES_0402-A93548-023,EMPTY,1K,1%,1/16W,LPDB,GENERIC; WATTAGE: 1/16W; OriginalSymbolOrigin: (-25,75); XY: (-6575,950); VER: 2; ROT: 0; PHYS_PAGE: 82; LOCATION: R4L18; IP: GENERIC; FP_TECH: LPDB; DRAWING: @RVP1_ADL_SB_ADP_S_DDR5_SODIMM_2DPC_LIB.H55_DG2_2DPC(SCH_1):PAGE454; CDS_LIB: discrete; PCB Footprint: SMR0402IA; CHIPS_PART_NAME: RES; CDS_PART_NAME: RES_0402-A93548-023,EMPTY,1K,1%,1/16W,LPDB,GENERIC; CDS_LOCATION: R4L18; ASI_MODEL: A93548-023
R4L20 = RES: CDS_PHYS_PART_NAME: RES_0402-G21796-187,CHIP,68.1K,1%,1/16W,LPDB,GENERIC; WATTAGE: 1/16W; OriginalSymbolOrigin: (-25,75); XY: (-6575,475); VER: 2; ROT: 0; PHYS_PAGE: 82; LOCATION: R4L20; IP: GENERIC; FP_TECH: LPDB; DRAWING: @RVP1_ADL_SB_ADP_S_DDR5_SODIMM_2DPC_LIB.H55_DG2_2DPC(SCH_1):PAGE454; CDS_LIB: discrete; PCB Footprint: SMR0402IA; SEC_TYPE: 0402; CHIPS_PART_NAME: RES; CDS_PART_NAME: RES_0402-G21796-187,CHIP,68.1K,1%,1/16W,LPDB,GENERIC; CDS_LOCATION: R4L20; ASI_MODEL: G21796-187
R4L21 = RES: CDS_PHYS_PART_NAME: RES_0402-G21796-187,EMPTY,68.1K,1%,1/16W,LPDB,GENERIC; WATTAGE: 1/16W; OriginalSymbolOrigin: (-25,75); XY: (-6575,1625); VER: 2; ROT: 0; PHYS_PAGE: 82; LOCATION: R4L21; IP: GENERIC; FP_TECH: LPDB; DRAWING: @RVP1_ADL_SB_ADP_S_DDR5_SODIMM_2DPC_LIB.H55_DG2_2DPC(SCH_1):PAGE454; CDS_LIB: discrete; PCB Footprint: SMR0402IA; CHIPS_PART_NAME: RES; CDS_PART_NAME: RES_0402-G21796-187,EMPTY,68.1K,1%,1/16W,LPDB,GENERIC; CDS_LOCATION: R4L21; ASI_MODEL: G21796-187
R5A34 = C_RES: CDS_PHYS_PART_NAME: C_RES_0201-G13778-001,RES,220K,1%,0.05W,TK2,GENERIC; CDS_LMAN_SYM_OUTLINE: -50,50,50,-50; FP_TECH: TK2; IP: GENERIC; ROOM: NONE; OriginalSymbolOrigin: (-25,75); XY: (-6175,3175); VER: 2; ROT: 0; PHYS_PAGE: 82; LOCATION: R5A34; DRAWING: @RVP1_ADL_SB_ADP_S_DDR5_SODIMM_2DPC_LIB.H55_DG2_2DPC(SCH_1):PAGE454; CDS_LIB: c_discrete; VARIANT: ?; PCB Footprint: CTK2_SM0201_650X350_MA; CHIPS_PART_NAME: C_RES; CDS_PART_NAME: C_RES_0201-G13778-001,RES,220K,1%,0.05W,TK2,GENERIC; CDS_LOCATION: R5A34
R5B1 = RES: CDS_PHYS_PART_NAME: RES_0402-G21796-187,CHIP,68.1K,1%,1/16W,LPDB,GENERIC; WATTAGE: 1/16W; OriginalSymbolOrigin: (-25,75); XY: (-7200,1625); VER: 2; ROT: 0; PHYS_PAGE: 82; LOCATION: R5B1; IP: GENERIC; FP_TECH: LPDB; DRAWING: @RVP1_ADL_SB_ADP_S_DDR5_SODIMM_2DPC_LIB.H55_DG2_2DPC(SCH_1):PAGE454; CDS_LIB: discrete; PCB Footprint: SMR0402IA; CHIPS_PART_NAME: RES; CDS_PART_NAME: RES_0402-G21796-187,CHIP,68.1K,1%,1/16W,LPDB,GENERIC; CDS_LOCATION: R5B1; ASI_MODEL: G21796-187
R5B3 = RES#1: CHIPS_PART_NAME: RES; CDS_PHYS_PART_NAME: RES_0402-A93549-017,EMPTY,2.2K,5%,1/16W,LPDB,GENERIC; WATTAGE: 1/16W; OriginalSymbolOrigin: (-75,25); XY: (-5475,3100); VER: 1; ROT: 0; PHYS_PAGE: 82; LOCATION: R5B3; IP: GENERIC; FP_TECH: LPDB; DRAWING: @RVP1_ADL_SB_ADP_S_DDR5_SODIMM_2DPC_LIB.H55_DG2_2DPC(SCH_1):PAGE454; CDS_LIB: discrete; PCB Footprint: SMR0402IA; SEC_TYPE: 0402; CDS_PART_NAME: RES_0402-A93549-017,EMPTY,2.2K,5%,1/16W,LPDB,GENERIC; CDS_LOCATION: R5B3; ASI_MODEL: A93549-017
R5L28 = RES: PART_NUMBER: A93548-023; CDS_PHYS_PART_NAME: RES_0402-A93548-023,EMPTY,1K,1%,1/16W,LPDB,GENERIC; WATTAGE: 1/16W; OriginalSymbolOrigin: (-25,75); XY: (-6575,2025); VER: 2; ROT: 0; PHYS_PAGE: 82; LOCATION: R5L28; IP: GENERIC; FP_TECH: LPDB; DRAWING: @RVP1_ADL_SB_ADP_S_DDR5_SODIMM_2DPC_LIB.H55_DG2_2DPC(SCH_1):PAGE454; CDS_LIB: discrete; PCB Footprint: SMR0402IA; CHIPS_PART_NAME: RES; CDS_PART_NAME: RES_0402-A93548-023,EMPTY,1K,1%,1/16W,LPDB,GENERIC; CDS_LOCATION: R5L28; ASI_MODEL: A93548-023
R5M5 = RES: PART_NUMBER: A93548-023; CDS_PHYS_PART_NAME: RES_0402-A93548-023,EMPTY,1K,1%,1/16W,LPDB,GENERIC; WATTAGE: 1/16W; OriginalSymbolOrigin: (-25,75); XY: (-7200,2025); VER: 2; ROT: 0; PHYS_PAGE: 82; LOCATION: R5M5; IP: GENERIC; FP_TECH: LPDB; DRAWING: @RVP1_ADL_SB_ADP_S_DDR5_SODIMM_2DPC_LIB.H55_DG2_2DPC(SCH_1):PAGE454; CDS_LIB: discrete; PCB Footprint: SMR0402IA; CHIPS_PART_NAME: RES; CDS_PART_NAME: RES_0402-A93548-023,EMPTY,1K,1%,1/16W,LPDB,GENERIC; CDS_LOCATION: R5M5; ASI_MODEL: A93548-023
R5M8 = RES: CDS_PHYS_PART_NAME: RES_0402-A93548-023,EMPTY,1K,1%,1/16W,LPDB,GENERIC; WATTAGE: 1/16W; OriginalSymbolOrigin: (-25,75); XY: (-7200,950); VER: 2; ROT: 0; PHYS_PAGE: 82; LOCATION: R5M8; IP: GENERIC; FP_TECH: LPDB; DRAWING: @RVP1_ADL_SB_ADP_S_DDR5_SODIMM_2DPC_LIB.H55_DG2_2DPC(SCH_1):PAGE454; CDS_LIB: discrete; PCB Footprint: SMR0402IA; CHIPS_PART_NAME: RES; CDS_PART_NAME: RES_0402-A93548-023,EMPTY,1K,1%,1/16W,LPDB,GENERIC; CDS_LOCATION: R5M8; ASI_MODEL: A93548-023
R5M11 = RES: CDS_PHYS_PART_NAME: RES_0402-G21796-187,CHIP,68.1K,1%,1/16W,LPDB,GENERIC; WATTAGE: 1/16W; OriginalSymbolOrigin: (-25,75); XY: (-7200,475); VER: 2; ROT: 0; PHYS_PAGE: 82; LOCATION: R5M11; IP: GENERIC; FP_TECH: LPDB; DRAWING: @RVP1_ADL_SB_ADP_S_DDR5_SODIMM_2DPC_LIB.H55_DG2_2DPC(SCH_1):PAGE454; CDS_LIB: discrete; PCB Footprint: SMR0402IA; SEC_TYPE: 0402; CHIPS_PART_NAME: RES; CDS_PART_NAME: RES_0402-G21796-187,CHIP,68.1K,1%,1/16W,LPDB,GENERIC; CDS_LOCATION: R5M11; ASI_MODEL: G21796-187
R8301 = RES: PART_NUMBER: A93548-023; CDS_PHYS_PART_NAME: RES_0402-A93548-023,EMPTY,1K,1%,1/16W,LPDB,GENERIC; WATTAGE: 1/16W; OriginalSymbolOrigin: (-25,75); XY: (-4900,1975); VER: 2; ROT: 0; PHYS_PAGE: 82; LOCATION: R8301; IP: GENERIC; FP_TECH: LPDB; DRAWING: @RVP1_ADL_SB_ADP_S_DDR5_SODIMM_2DPC_LIB.H55_DG2_2DPC(SCH_1):PAGE454; CDS_LIB: discrete; PCB Footprint: SMR0402IA; CHIPS_PART_NAME: RES; CDS_PART_NAME: RES_0402-A93548-023,EMPTY,1K,1%,1/16W,LPDB,GENERIC; CDS_LOCATION: R8301; ASI_MODEL: A93548-023
R8302 = RES: PART_NUMBER: A93548-023; CDS_PHYS_PART_NAME: RES_0402-A93548-023,EMPTY,1K,1%,1/16W,LPDB,GENERIC; WATTAGE: 1/16W; OriginalSymbolOrigin: (-25,75); XY: (-4900,1575); VER: 2; ROT: 0; PHYS_PAGE: 82; LOCATION: R8302; IP: GENERIC; FP_TECH: LPDB; DRAWING: @RVP1_ADL_SB_ADP_S_DDR5_SODIMM_2DPC_LIB.H55_DG2_2DPC(SCH_1):PAGE454; CDS_LIB: discrete; PCB Footprint: SMR0402IA; CHIPS_PART_NAME: RES; CDS_PART_NAME: RES_0402-A93548-023,EMPTY,1K,1%,1/16W,LPDB,GENERIC; CDS_LOCATION: R8302; ASI_MODEL: A93548-023
R8303 = RES: PART_NUMBER: A93548-023; CDS_PHYS_PART_NAME: RES_0402-A93548-023,EMPTY,1K,1%,1/16W,LPDB,GENERIC; WATTAGE: 1/16W; OriginalSymbolOrigin: (-25,75); XY: (-4275,1975); VER: 2; ROT: 0; PHYS_PAGE: 82; LOCATION: R8303; IP: GENERIC; FP_TECH: LPDB; DRAWING: @RVP1_ADL_SB_ADP_S_DDR5_SODIMM_2DPC_LIB.H55_DG2_2DPC(SCH_1):PAGE454; CDS_LIB: discrete; PCB Footprint: SMR0402IA; CHIPS_PART_NAME: RES; CDS_PART_NAME: RES_0402-A93548-023,EMPTY,1K,1%,1/16W,LPDB,GENERIC; CDS_LOCATION: R8303; ASI_MODEL: A93548-023
R8304 = RES: PART_NUMBER: A93548-023; CDS_PHYS_PART_NAME: RES_0402-A93548-023,EMPTY,1K,1%,1/16W,LPDB,GENERIC; WATTAGE: 1/16W; OriginalSymbolOrigin: (-25,75); XY: (-4275,1575); VER: 2; ROT: 0; PHYS_PAGE: 82; LOCATION: R8304; IP: GENERIC; FP_TECH: LPDB; DRAWING: @RVP1_ADL_SB_ADP_S_DDR5_SODIMM_2DPC_LIB.H55_DG2_2DPC(SCH_1):PAGE454; CDS_LIB: discrete; PCB Footprint: SMR0402IA; CHIPS_PART_NAME: RES; CDS_PART_NAME: RES_0402-A93548-023,EMPTY,1K,1%,1/16W,LPDB,GENERIC; CDS_LOCATION: R8304; ASI_MODEL: A93548-023